# EAGLE board TSC8-75 (EAGLE 6.6.0), part 1 of 2
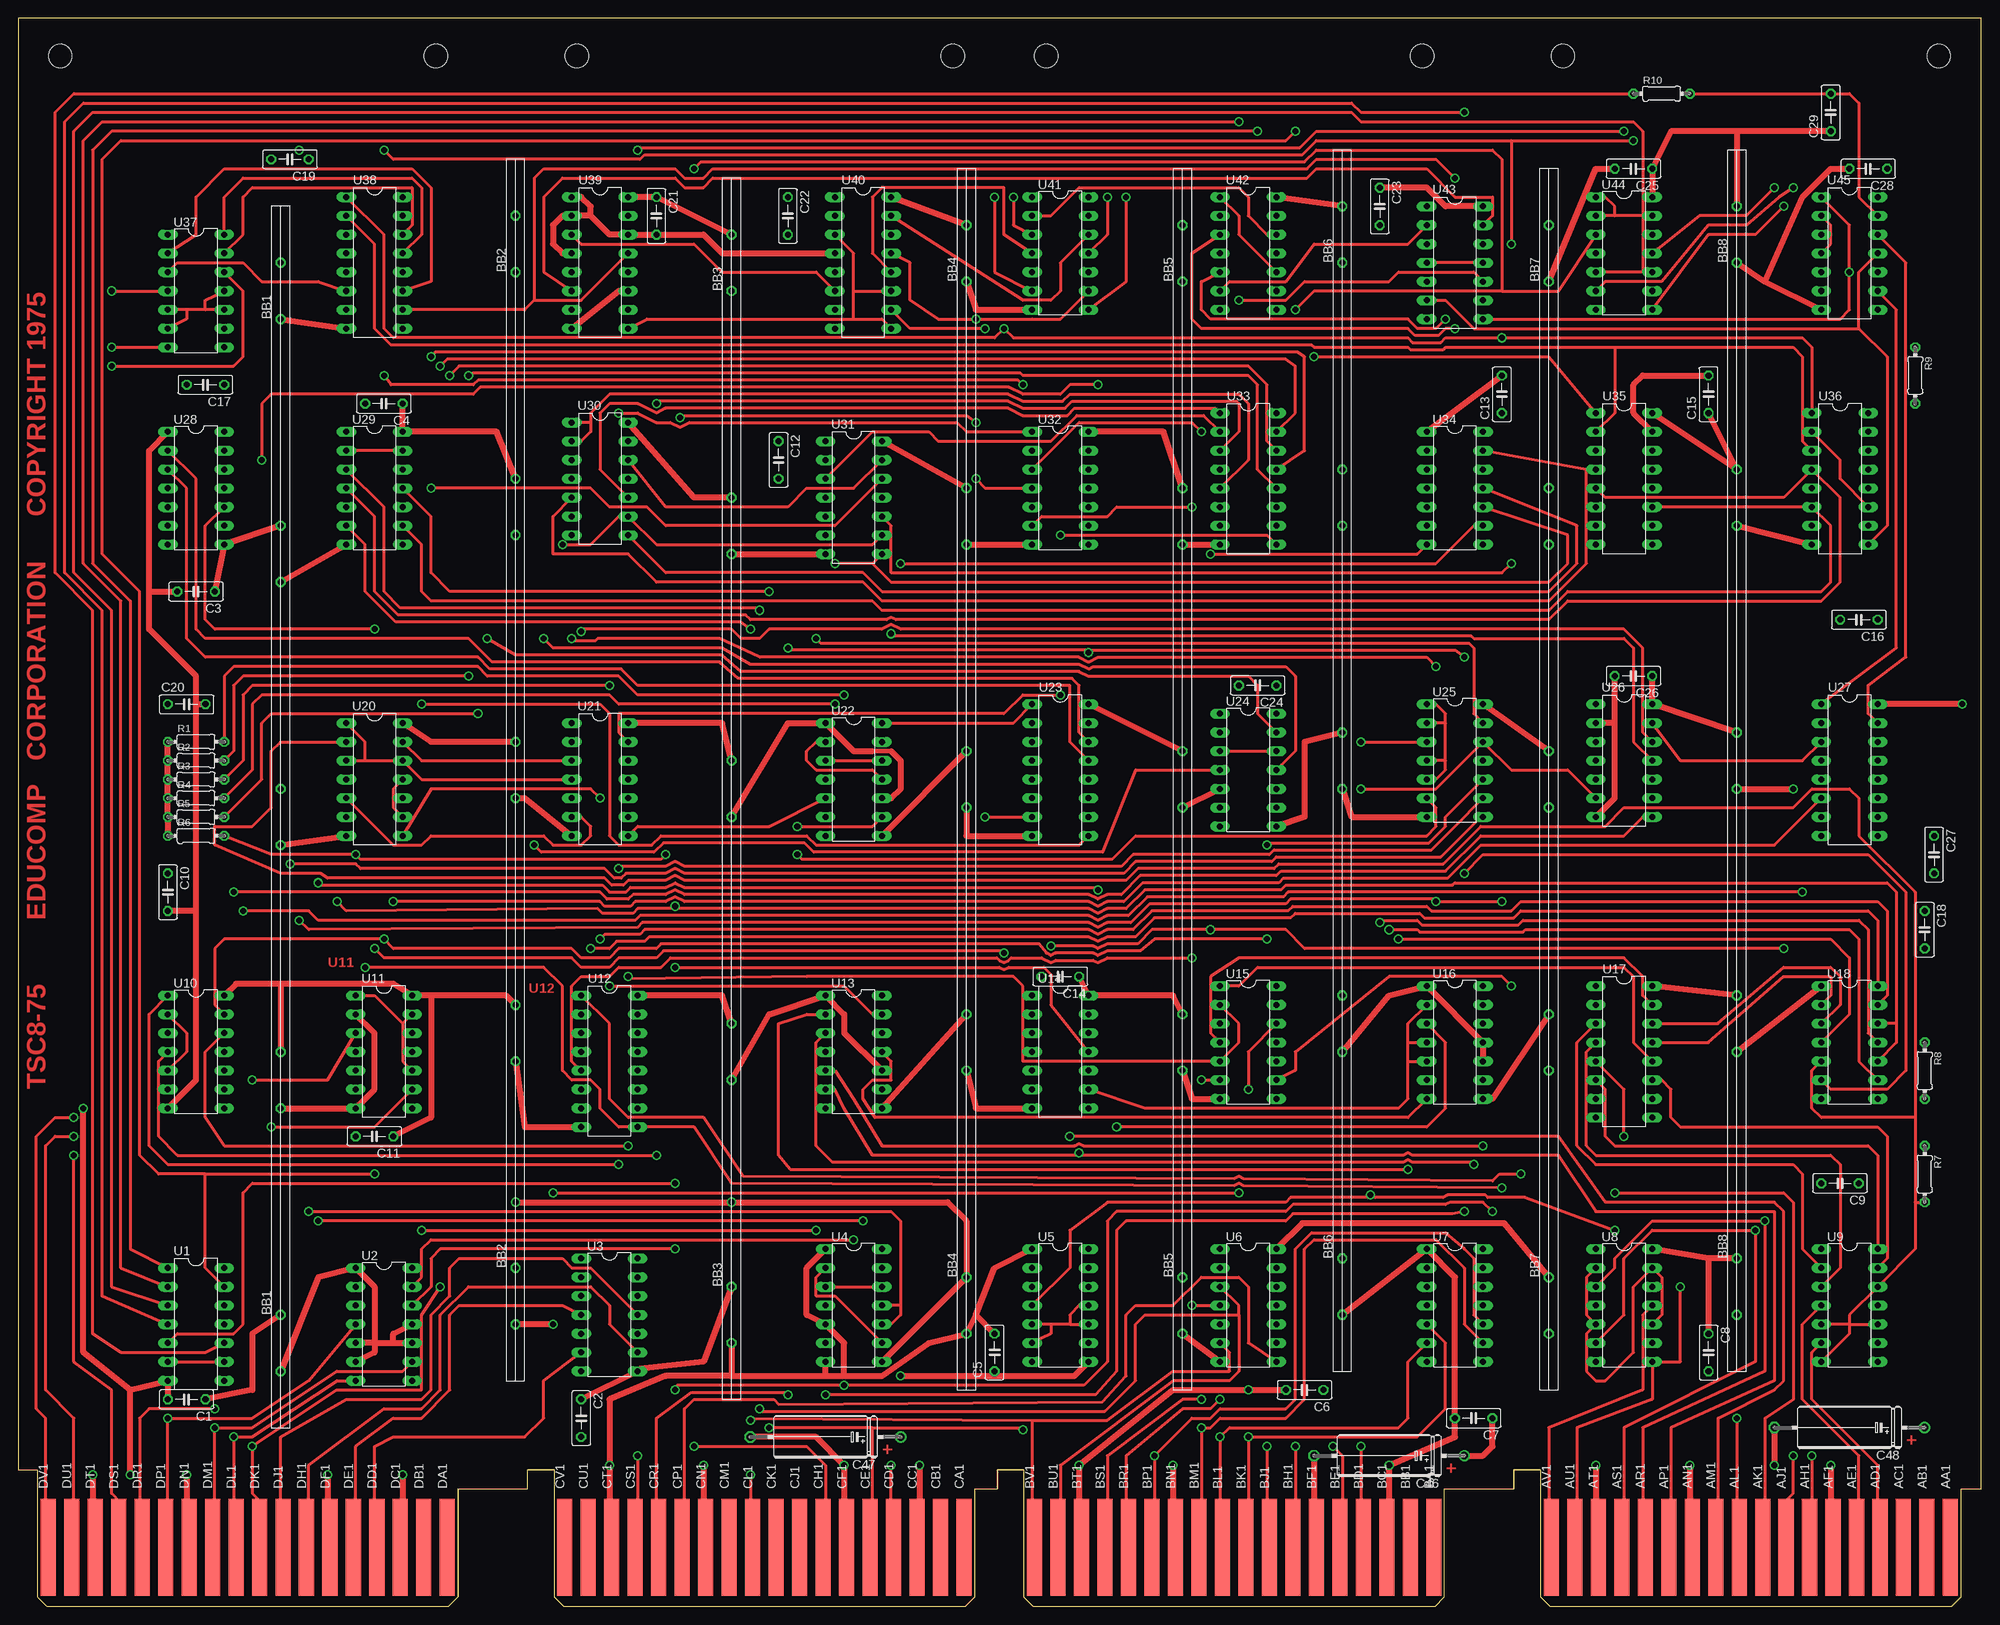
[diagram p4: board, top side]
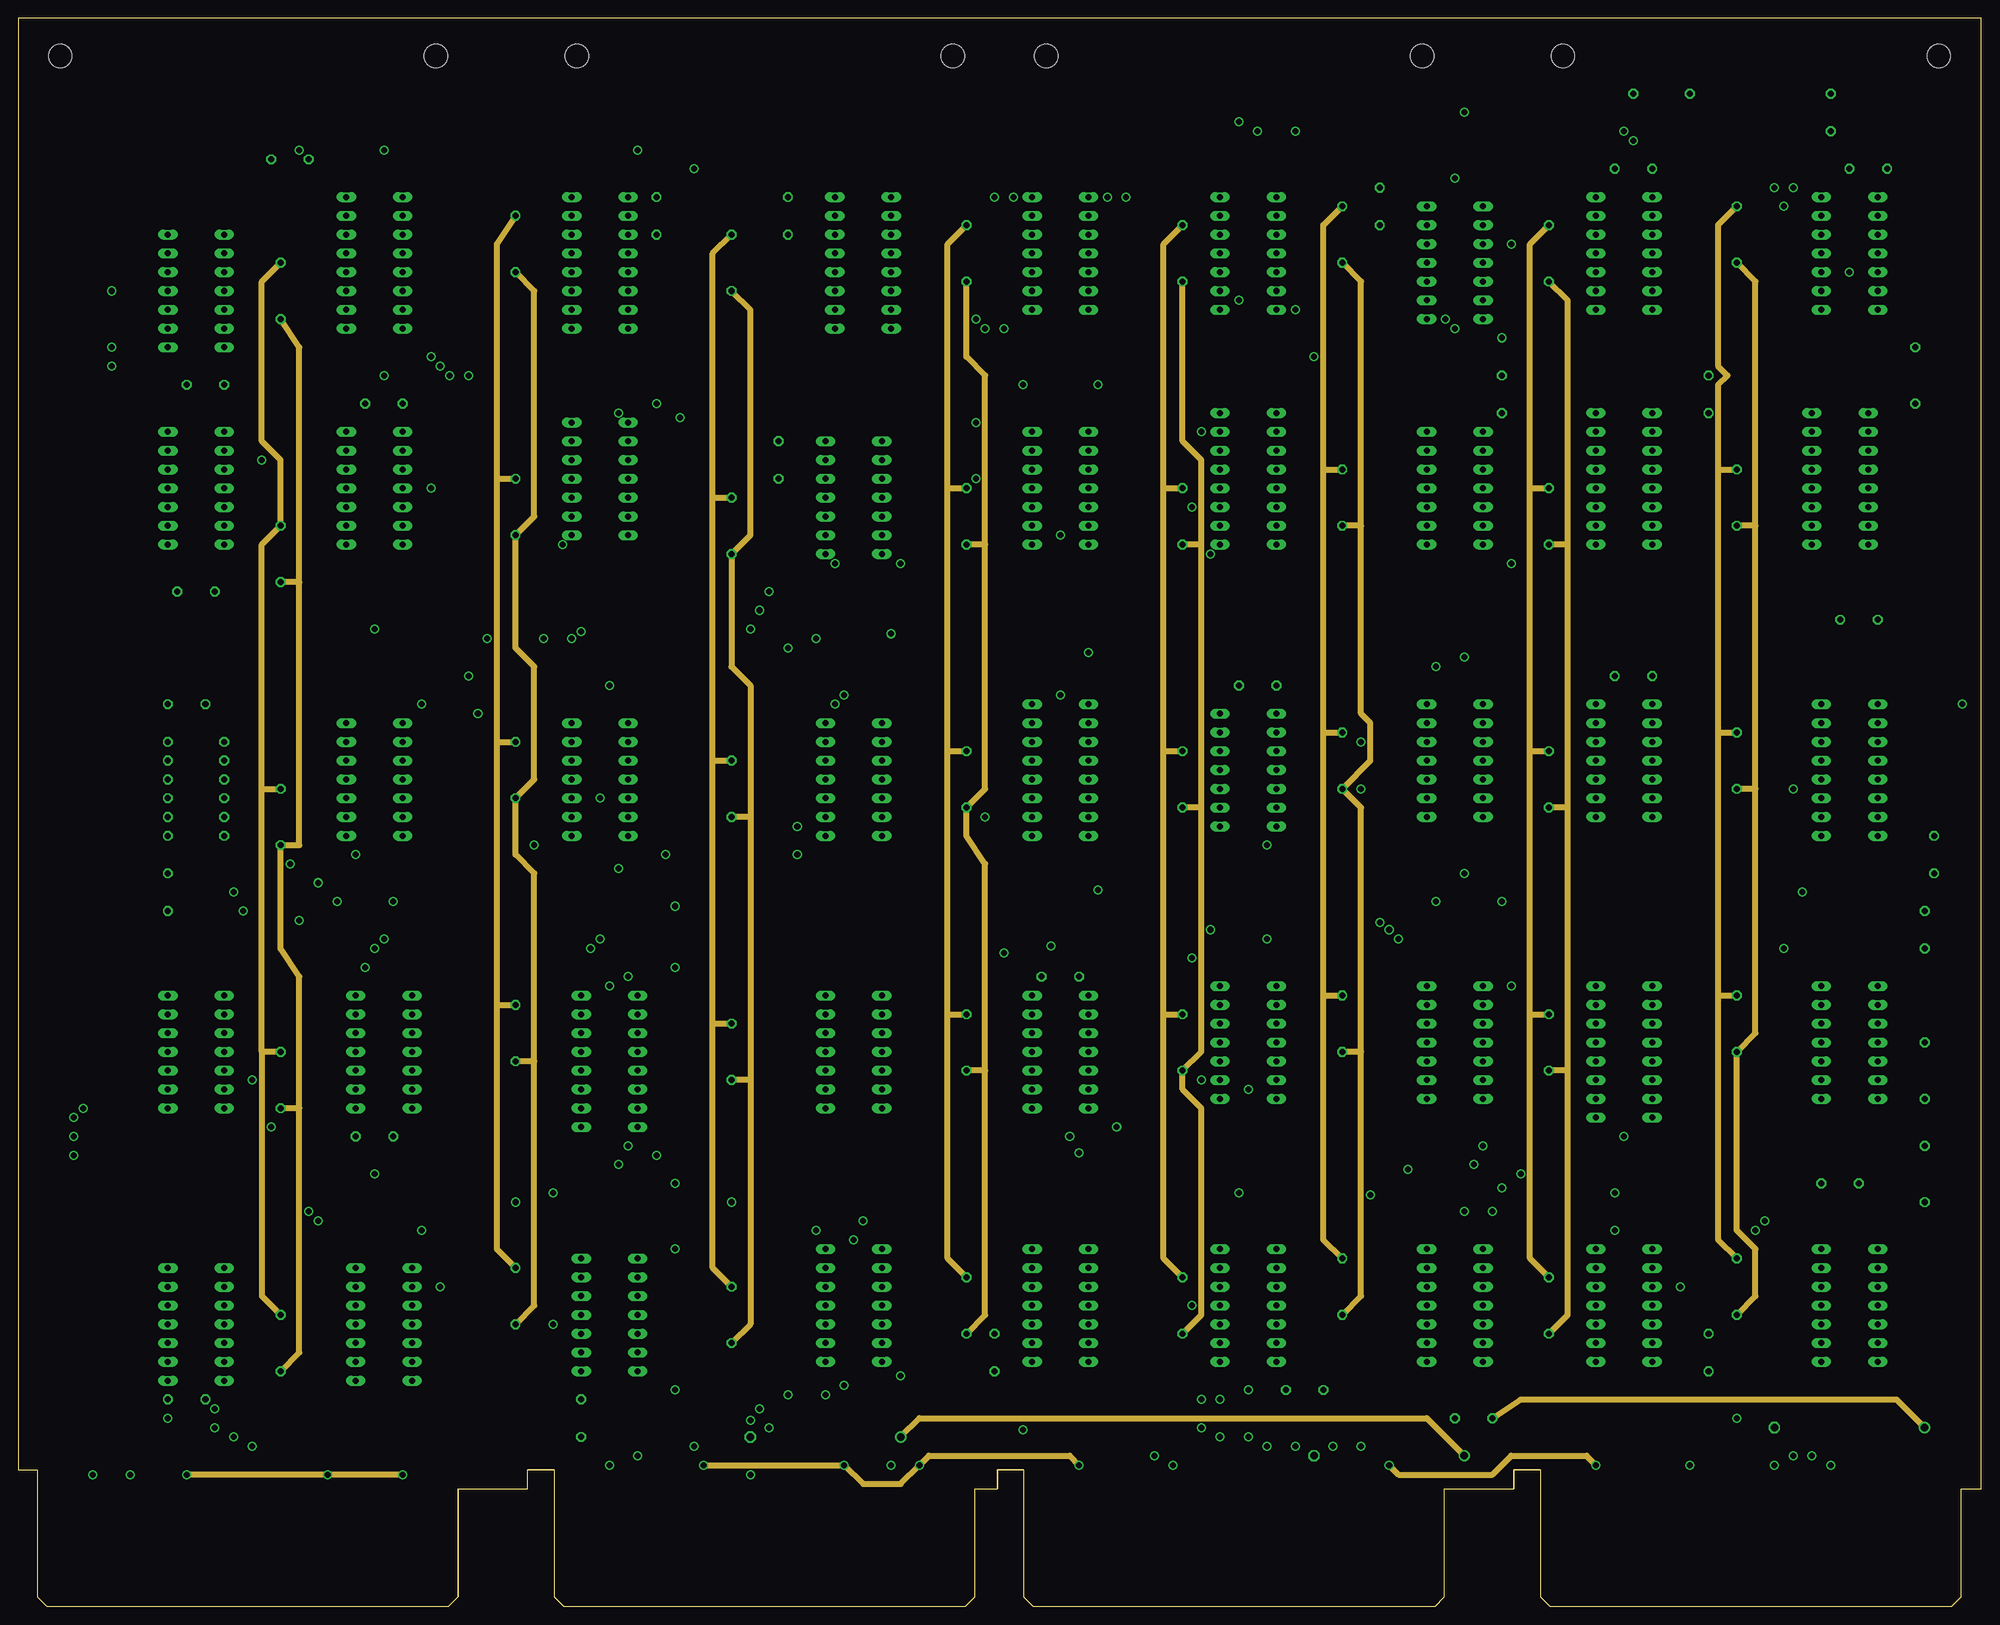
[diagram p5: board, inner layer Busbar]
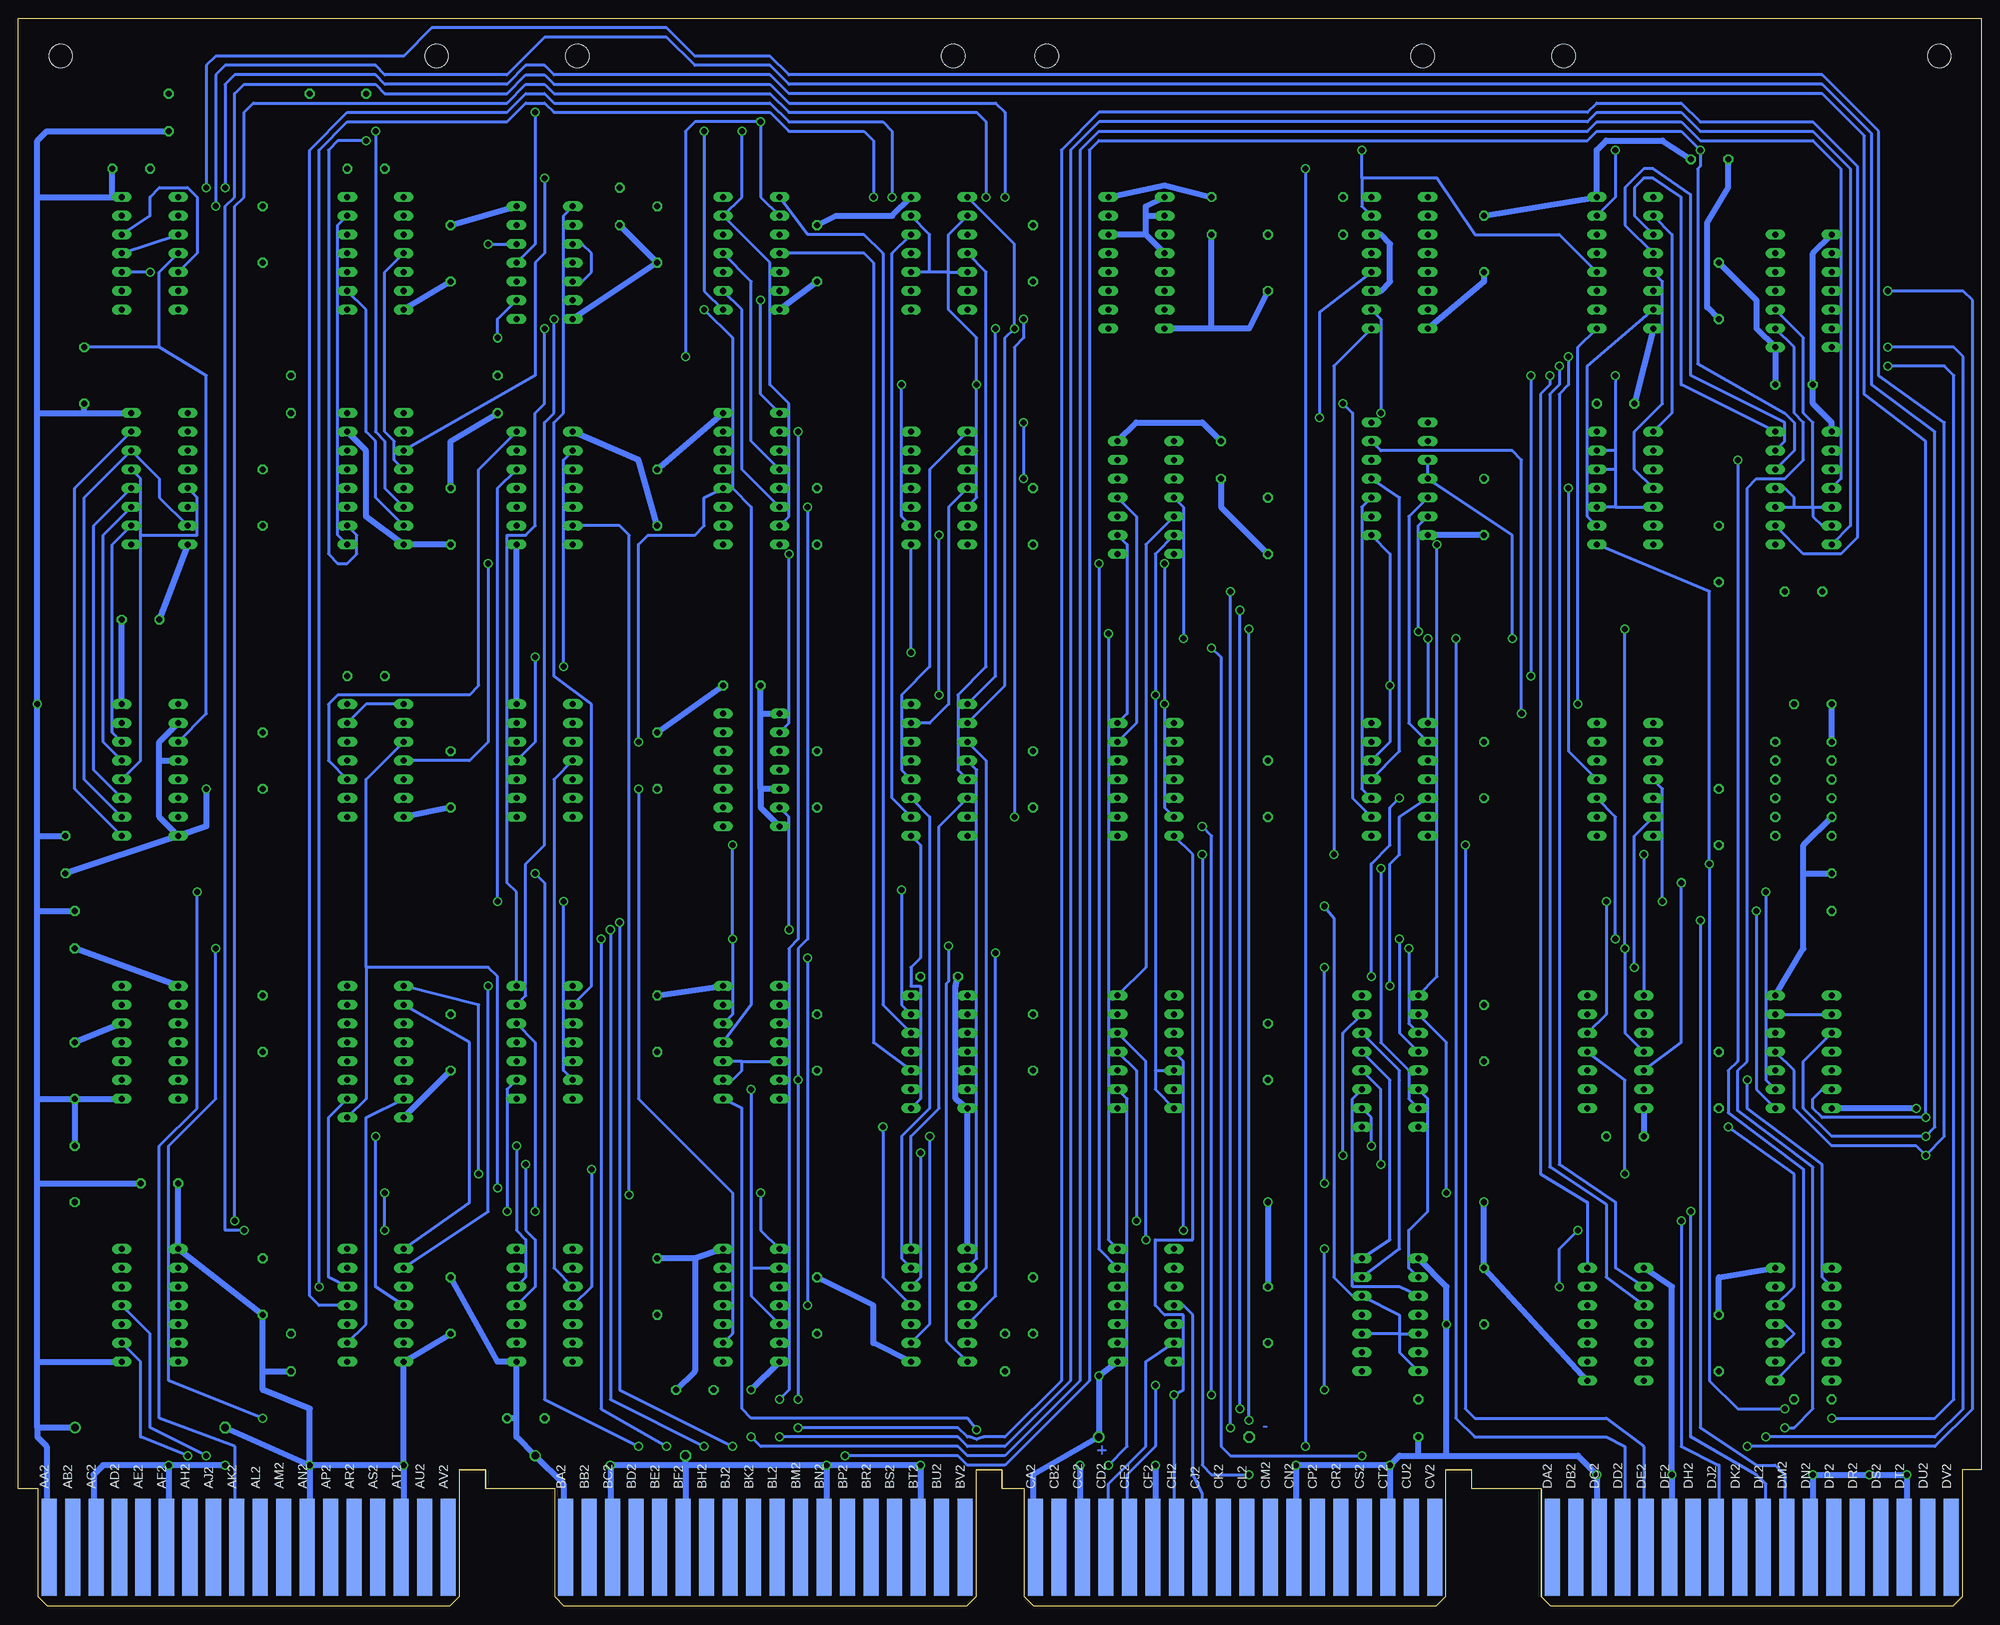
[diagram p6: board, bottom side, seen from below]

Size 265.3 x 214.63 mm. Coordinates in mm from the lower left corner, seen from the top.
Copper layers (1+2+16): Top 0.035mm / dielectric 1.5mm / Busbar 0.035mm / dielectric 0.15mm / Bottom 0.035mm
Design rules "16mils *": minimum track width 16mil, minimum drill 32mil, track to track 15mil, track to pad 10mil, pad to pad 10mil, via to via 10mil, smd to smd 10mil, copper to edge 13mil, drill to drill 10mil, minimum pad ring 10mil, minimum via ring 8mil, stop-mask expansion 0mil, vias tented up to drill 0mil, thermal gap 10mil

## Footprints (pad centres in the part's own frame; a part is rotated, then mirrored left to right if it is on the bottom)
BUSBAR = drill 0.813 octagon: GND1 7.62,1.27; GND2 43.18,1.27; GND3 78.74,1.27; GND4 114.3,1.27; GND5 149.86,1.27; VCC1 15.24,1.27; VCC2 50.8,1.27; VCC3 86.36,1.27; VCC4 121.92,1.27; VCC5 157.48,1.27
C050-025X075 = drill 0.813 octagon: 1 -2.54,0; 2 2.54,0
E12-8 = drill 1.016: + -10.16,0 | drill 1.016 octagon: - 10.16,0
EDGE-CON8 = smd 2.032 x 13.106: AA1 261.303,7.938; AB1 258.127,7.938; AC1 254.952,7.938; AD1 251.778,7.938; AE1 248.602,7.938; AF1 245.428,7.938; AH1 242.252,7.938; AJ1 239.077,7.938; AK1 235.903,7.938; AL1 232.727,7.938; AM1 229.553,7.938; AN1 226.377,7.938; AP1 223.202,7.938; AR1 220.028,7.938; AS1 216.852,7.938; AT1 213.678,7.938; AU1 210.502,7.938; AV1 207.327,7.938; BA1 191.452,7.938; BB1 188.278,7.938; BC1 185.102,7.938; BD1 181.928,7.938; BE1 178.752,7.938; BF1 175.577,7.938; BH1 172.403,7.938; BJ1 169.227,7.938; BK1 166.053,7.938; BL1 162.877,7.938; BM1 159.702,7.938; BN1 156.528,7.938; BP1 153.352,7.938; BR1 150.178,7.938; BS1 147.002,7.938; BT1 143.827,7.938; BU1 140.653,7.938; BV1 137.477,7.938; CA1 127.953,7.938; CB1 124.778,7.938; CC1 121.603,7.938; CD1 118.427,7.938; CE1 115.252,7.938; CF1 112.078,7.938; CH1 108.903,7.938; CJ1 105.728,7.938; CK1 102.552,7.938; CL1 99.377,7.938; CM1 96.203,7.938; CN1 93.028,7.938; CP1 89.853,7.938; CR1 86.677,7.938; CS1 83.502,7.938; CT1 80.328,7.938; CU1 77.153,7.938; CV1 73.978,7.938; DA1 58.102,7.938; DB1 54.928,7.938; DC1 51.752,7.938; DD1 48.578,7.938; DE1 45.403,7.938; DF1 42.227,7.938; DH1 39.053,7.938; DJ1 35.877,7.938; DK1 32.703,7.938; DL1 29.527,7.938; DM1 26.352,7.938; DN1 23.177,7.938; DP1 20.003,7.938; DR1 16.828,7.938; DS1 13.652,7.938; DT1 10.477,7.938; DU1 7.303,7.938; DV1 4.128,7.938 | smd 2.032 x 13.106 bottom: AA2 261.303,7.938; AB2 258.127,7.938; AC2 254.952,7.938; AD2 251.778,7.938; AE2 248.602,7.938; AF2 245.428,7.938; AH2 242.252,7.938; AJ2 239.077,7.938; AK2 235.903,7.938; AL2 232.727,7.938; AM2 229.553,7.938; AN2 226.377,7.938; AP2 223.202,7.938; AR2 220.028,7.938; AS2 216.852,7.938; AT2 213.678,7.938; AU2 210.502,7.938; AV2 207.327,7.938; BA2 191.452,7.938; BB2 188.278,7.938; BC2 185.102,7.938; BD2 181.928,7.938; BE2 178.752,7.938; BF2 175.577,7.938; BH2 172.403,7.938; BJ2 169.227,7.938; BK2 166.053,7.938; BL2 162.877,7.938; BM2 159.702,7.938; BN2 156.528,7.938; BP2 153.352,7.938; BR2 150.178,7.938; BS2 147.002,7.938; BT2 143.827,7.938; BU2 140.653,7.938; BV2 137.477,7.938; CA2 127.953,7.938; CB2 124.778,7.938; CC2 121.603,7.938; CD2 118.427,7.938; CE2 115.252,7.938; CF2 112.078,7.938; CH2 108.903,7.938; CJ2 105.728,7.938; CK2 102.552,7.938; CL2 99.377,7.938; CM2 96.203,7.938; CN2 93.028,7.938; CP2 89.853,7.938; CR2 86.677,7.938; CS2 83.502,7.938; CT2 80.328,7.938; CU2 77.153,7.938; CV2 73.978,7.938; DA2 58.102,7.938; DB2 54.928,7.938; DC2 51.752,7.938; DD2 48.578,7.938; DE2 45.403,7.938; DF2 42.227,7.938; DH2 39.053,7.938; DJ2 35.877,7.938; DK2 32.703,7.938; DL2 29.527,7.938; DM2 26.352,7.938; DN2 23.177,7.938; DP2 20.003,7.938; DR2 16.828,7.938; DS2 13.652,7.938; DT2 10.477,7.938; DU2 7.303,7.938; DV2 4.128,7.938
0204/7 = drill 0.813 octagon: 1 -3.81,0; 2 3.81,0
DIL14 = drill 0.813 long: 1 -7.62,-3.81; 2 -5.08,-3.81; 3 -2.54,-3.81; 4 0,-3.81; 5 2.54,-3.81; 6 5.08,-3.81; 7 7.62,-3.81; 8 7.62,3.81; 9 5.08,3.81; 10 2.54,3.81; 11 0,3.81; 12 -2.54,3.81; 13 -5.08,3.81; 14 -7.62,3.81
DIL16 = drill 0.813 long: 1 -8.89,-3.81; 2 -6.35,-3.81; 3 -3.81,-3.81; 4 -1.27,-3.81; 5 1.27,-3.81; 6 3.81,-3.81; 7 6.35,-3.81; 8 8.89,-3.81; 9 8.89,3.81; 10 6.35,3.81; 11 3.81,3.81; 12 1.27,3.81; 13 -1.27,3.81; 14 -3.81,3.81; 15 -6.35,3.81; 16 -8.89,3.81
OMNIBUS = hole 3.175: 208.915,209.55; 259.715,209.55; 189.865,209.55; 139.065,209.55; 75.616,209.55; 126.416,209.55; 56.566,209.55; 5.766,209.55

## Placement (x,y rotation side)
BB1  BUSBAR  [BUSBAR]  36.7,24.13 90 top
BB2  BUSBAR  [BUSBAR]  68.45,30.48 90 top
BB3  BUSBAR  [BUSBAR]  97.66,27.94 90 top
BB4  BUSBAR  [BUSBAR]  129.41,29.21 90 top
BB5  BUSBAR  [BUSBAR]  158.62,29.21 90 top
BB6  BUSBAR  [BUSBAR]  180.21,31.75 90 top
BB7  BUSBAR  [BUSBAR]  208.15,29.21 90 top
BB8  BUSBAR  [BUSBAR]  233.55,31.75 90 top
C1  .01uF  [C050-025X075]  22.73,27.94 180 top
C2  .01uF  [C050-025X075]  76.07,25.4 270 top
C3  .01uF  [C050-025X075]  24,137.16 180 top
C4  .01uF  [C050-025X075]  49.4,162.56 180 top
C5  .01uF  [C050-025X075]  131.95,34.29 90 top
C6  .01uF  [C050-025X075]  173.86,29.21 180 top
C7  .01uF  [C050-025X075]  196.72,25.4 180 top
C8  .01uF  [C050-025X075]  228.47,34.29 270 top
C9  .01uF  [C050-025X075]  246.25,57.15 180 top
C10  .01uF  [C050-025X075]  20.19,96.52 270 top
C11  .01uF  [C050-025X075]  48.13,63.5 180 top
C12  .01uF  [C050-025X075]  102.74,154.94 270 top
C13  .01uF  [C050-025X075]  200.53,163.83 90 top
C14  .01uF  [C050-025X075]  140.84,85.09 180 top
C15  .01uF  [C050-025X075]  228.47,163.83 90 top
C16  .01uF  [C050-025X075]  248.79,133.35 180 top
C17  .01uF  [C050-025X075]  25.27,165.1 180 top
C18  .01uF  [C050-025X075]  257.68,91.44 270 top
C19  .01uF  [C050-025X075]  36.7,195.58 180 top
C20  .01uF  [C050-025X075]  22.73,121.92 0 top
C21  .01uF  [C050-025X075]  86.23,187.96 270 top
C22  .01uF  [C050-025X075]  104.01,187.96 270 top
C23  .01uF  [C050-025X075]  184.02,189.23 270 top
C24  .01uF  [C050-025X075]  167.51,124.46 180 top
C25  .01uF  [C050-025X075]  218.31,194.31 180 top
C26  .01uF  [C050-025X075]  218.31,125.73 180 top
C27  .01uF  [C050-025X075]  258.95,101.6 270 top
C28  .01uF  [C050-025X075]  250.06,194.31 180 top
C29  100pF  [C050-025X075]  244.98,201.93 90 top
C46  6.8uF  [E12-8]  185.29,20.32 180 top
C47  6.8uF  [E12-8]  109.09,22.86 180 top
C48  6.8uF  [E12-8]  247.52,24.13 180 top
EDGE  edge  [EDGE-CON8]  -0.13,0 0 top
R1  1K  [0204/7]  24,116.84 0 top
R2  1K  [0204/7]  24,114.3 0 top
R3  1K  [0204/7]  24,111.76 0 top
R4  1K  [0204/7]  24,109.22 0 top
R5  1K  [0204/7]  24,106.68 0 top
R6  1K  [0204/7]  24,104.14 0 top
R7  1K  [0204/7]  257.68,58.42 270 top
R8  1K  [0204/7]  257.68,72.39 270 top
R9  1K  [0204/7]  256.41,166.37 270 top
R10  120  [0204/7]  222.12,204.47 0 top
U1  7400N  [DIL14]  24,38.1 270 top
U2  SP380N  [DIL14]  49.4,38.1 270 top
U3  SP380N  [DIL14]  79.88,39.37 270 top
U4  SP380N  [DIL14]  112.9,40.64 270 top
U5  SP380N  [DIL14]  140.84,40.64 270 top
U6  7438N  [DIL14]  166.24,40.64 270 top
U7  SP314N  [DIL14]  194.18,40.64 270 top
U8  7438N  [DIL14]  217.04,40.64 270 top
U9  SP380N  [DIL14]  247.52,40.64 270 top
U10  7438N  [DIL14]  24,74.93 270 top
U11  7474N  [DIL14]  49.4,74.93 270 top
U12  74174N  [DIL16]  79.88,73.66 270 top
U13  SP380N  [DIL14]  112.9,74.93 270 top
U14  7408N  [DIL14]  140.84,74.93 270 top
U15  7438N  [DIL14]  166.24,76.2 270 top
U16  SP380N  [DIL14]  194.18,76.2 270 top
U17  74174N  [DIL16]  217.04,74.93 270 top
U18  SP380N  [DIL14]  247.52,76.2 270 top
U20  7404N  [DIL14]  48.13,111.76 270 top
U21  7400N  [DIL14]  78.61,111.76 270 top
U22  SP380N  [DIL14]  112.9,111.76 270 top
U23  74174N  [DIL16]  140.84,113.03 270 top
U24  SP380N  [DIL14]  166.24,113.03 270 top
U25  7438N  [DIL14]  194.18,114.3 270 top
U26  7474N  [DIL14]  217.04,114.3 270 top
U27  7485N  [DIL16]  247.52,113.03 270 top
U28  SP380N  [DIL14]  24,151.13 270 top
U29  7438N  [DIL14]  48.13,151.13 270 top
U30  7410N  [DIL14]  78.61,152.4 270 top
U31  7404N  [DIL14]  112.9,149.86 270 top
U32  7438N  [DIL14]  140.84,151.13 270 top
U33  7442N  [DIL16]  166.24,152.4 270 top
U34  SP380N  [DIL14]  194.18,151.13 270 top
U35  74157N  [DIL16]  217.04,152.4 270 top
U36  74174N  [DIL16]  246.25,152.4 270 top
U37  SP380N  [DIL14]  24,177.8 270 top
U38  74174N  [DIL16]  48.13,181.61 270 top
U39  7485N  [DIL16]  78.61,181.61 270 top
U40  7485N  [DIL16]  114.17,181.61 270 top
U41  7438N  [DIL14]  140.84,182.88 270 top
U42  7404N  [DIL14]  166.24,182.88 270 top
U43  7408N  [DIL14]  194.18,181.61 270 top
U44  7438N  [DIL14]  217.04,182.88 270 top
U45  7474N  [DIL14]  247.52,182.88 270 top
U$1  OUTLINE-OMNIBUS  [OMNIBUS]  -0.13,0 0 top

## Tracks (layer width: path | path; a pad name or v marks a point on that pad's centre or on a via)
!C0  (via drill 0.81)
  Top 0.406: EDGE.CE1 115.44,8.26 115.44,24.13 | 115.44,24.13 v101.47,24.13 | 115.44,24.13 135.44,24.13 v135.76,23.81 | U29.11 55.75,147.32 55.75,139.7 58.29,137.16 v101.47,137.16
  Bottom 0.406: v101.47,24.13 v101.47,137.16 | v135.76,23.81 137.03,25.4 166.24,25.4 167.51,26.67 167.51,67.31 U15.8
!C1  (via drill 0.81)
  Top 0.406: v91.31,21.59 106.55,21.59 109.09,19.05 109.09,8.26 EDGE.CH1 | v91.31,194.31 92.27,195.26 173.86,195.26 175.45,196.85 199.26,196.85 200.53,195.58 200.53,177.8 | 200.53,177.8 208.15,177.8 U44.3 | v172.59,175.26 175.13,177.8 200.53,177.8
  Bottom 0.406: v91.31,194.31 v91.31,21.59 | U15.11 166.24,81.28 166.24,148.59 168.78,151.13 168.78,171.45 v172.59,175.26
!DATA00  (via drill 0.81)
  Top 0.406: EDGE.AR1 219.58,8.26 219.58,24.13 236.09,31.75 v236.09,52.07 220.85,52.07 215.77,46.99 215.77,45.72 U8.3 | U41.3 134.49,186.69 v134.49,190.5
  Bottom 0.406: v134.49,190.5 134.49,200.66 135.76,201.93 161.16,201.93 163.7,204.47 192.91,204.47 194.18,205.74 196.72,205.74 199.26,203.2 233.55,203.2 234.82,201.93 234.82,190.5 236.09,189.23 v236.09,52.07
!DATA01  (via drill 0.81)
  Top 0.406: EDGE.AS1 217.04,8.26 217.04,24.13 234.82,33.02 v234.82,50.8 220.85,50.8 217.04,46.99 217.04,39.37 U8.6 | U41.6 131.95,180.34 v131.95,190.5
  Bottom 0.406: v234.82,50.8 237.36,50.8 237.36,189.23 236.09,190.5 236.09,204.47 234.82,205.74 217.04,205.74 215.77,204.47 199.26,204.47 196.72,207.01 194.18,207.01 192.91,205.74 163.7,205.74 161.16,203.2 133.22,203.2 131.95,201.93 v131.95,190.5
!DATA02  (via drill 0.81)
  Top 0.406: EDGE.AU1 210.69,8.26 210.69,24.13 220.85,27.94 U8.8 224.66,33.02 v224.66,43.18 | U41.8 149.73,179.07 v149.73,190.5
  Bottom 0.406: v149.73,190.5 149.73,198.12 151,199.39 161.16,199.39 163.7,201.93 192.91,201.93 194.18,203.2 196.72,203.2 199.26,200.66 220.85,200.66 224.66,196.85 v224.66,43.18
!DATA03  (via drill 0.81)
  Top 0.406: EDGE.AV1 206.88,8.26 206.88,24.13 219.58,29.21 219.58,39.37 U8.11 | U41.11 147.19,185.42 v147.19,190.5
  Bottom 0.406: U8.11 224.66,40.64 225.93,41.91 225.93,196.85 220.85,201.93 199.26,201.93 196.72,204.47 194.18,204.47 192.91,203.2 163.7,203.2 161.16,200.66 148.46,200.66 147.19,199.39 v147.19,190.5
!DATA04  (via drill 0.81)
  Top 0.406: EDGE.BR1 149.73,8.26 149.73,20.32 157.35,26.67 161.16,26.67 v162.43,27.94 | v159.89,158.75 158.62,160.02 143.38,160.02 U32.3
  Bottom 0.406: v162.43,27.94 161.16,29.21 161.16,78.74 | 161.16,78.74 161.16,88.9 159.89,90.17 v159.89,158.75 | 161.16,78.74 U15.3
!DATA05  (via drill 0.81)
  Top 0.406: EDGE.BS1 147.19,8.26 147.19,20.32 157.35,27.94 v159.89,27.94 | v159.89,71.12 U15.6 | v158.62,148.59 148.46,148.59 147.19,147.32 138.3,147.32 U32.6
  Bottom 0.406: v159.89,27.94 v159.89,71.12 159.89,88.9 158.62,90.17 v158.62,148.59
!DATA06  (via drill 0.81)
  Top 0.406: EDGE.BU1 140.84,8.26 140.84,19.05 156.08,30.48 163.7,30.48 164.97,31.75 164.97,39.37 | U6.3 164.97,40.64 164.97,39.37 | 164.97,39.37 152.27,39.37 151,38.1 151,30.48 146.88,26.35 100.52,26.35 v100.2,26.67 | v100.2,134.62 99.89,134.94 51.62,134.94 49.4,137.16 49.4,148.59 U29.3
  Bottom 0.406: v100.2,26.67 v100.2,134.62
!DATA07  (via drill 0.81)
  Top 0.406: EDGE.BV1 137.03,8.26 137.03,25.08 | 137.03,25.08 147.19,25.08 156.08,31.75 163.7,31.75 163.7,34.29 U6.6 | v98.93,25.08 99.25,25.4 137.03,25.08 | v98.93,132.08 97.66,133.03 50.99,133.03 46.86,137.16 46.86,143.51 U29.6
  Bottom 0.406: v98.93,132.08 98.93,25.4 v98.93,25.08
!DATA08  (via drill 0.81)
  Top 0.406: EDGE.DR1 16.38,8.26 16.38,25.4 17.65,26.67 v26.54,26.67 | v36.7,100.33 45.59,100.33 46.23,99.69 79.25,99.69 80.52,98.42 81.47,98.42 82.11,99.06 87.5,99.06 88.77,99.69 90.04,99.06 149.41,99.06 151,100.65 169.42,100.65 170.05,101.28 192.28,101.28 197.68,106.68 U25.8
  Bottom 0.406: v26.54,26.67 32.89,26.67 36.7,30.48 v36.7,100.33 36.7,137.16 U29.8
!DATA09  (via drill 0.81)
  Top 0.406: EDGE.DS1 13.84,8.26 13.84,13.97 12.57,15.24 12.57,29.21 7.49,33.02 v7.49,60.96 | v239.9,191.77 238,190.5 233.55,186.69 228.47,186.69 222.12,179.07 214.5,179.07 U44.6
  Bottom 0.406: v239.9,191.77 239.9,208.28 238.63,209.55 213.23,209.55 209.42,213.36 177.67,213.36 173.86,209.55 163.7,209.55 161.16,207.01 21.46,207.01 13.84,199.39 13.84,166.37 4.95,160.02 4.95,63.5 v7.49,60.96 8.76,62.23 20.19,62.23 25.27,67.31 25.27,72.39 U10.11
!DATA10  (via drill 0.81)
  Top 0.406: EDGE.DU1 7.49,8.26 7.49,25.4 3.68,29.21 3.68,62.23 4.95,63.5 v7.49,63.5 | v238.63,189.23 234.82,185.42 228.47,185.42 U44.8
  Bottom 0.406: v238.63,189.23 238.63,207.01 237.36,208.28 217.04,208.28 215.77,207.01 199.26,207.01 194.18,212.09 177.67,212.09 173.86,208.28 163.7,208.28 161.16,205.74 21.46,205.74 14.79,199.07 14.79,165.1 6.22,158.75 6.22,64.77 v7.49,63.5 20.19,63.5 24,67.31 24,73.66 U10.3
!DATA11  (via drill 0.81)
  Top 0.406: EDGE.DV1 3.68,8.26 3.68,25.4 2.41,26.67 2.41,63.5 4.95,66.04 v7.49,66.04 | v237.36,191.77 233.55,187.96 227.2,187.96 U44.11
  Bottom 0.406: v237.36,191.77 237.36,205.74 236.09,207.01 217.04,207.01 215.77,205.74 199.26,205.74 196.72,208.28 194.18,208.28 192.91,207.01 163.7,207.01 161.16,204.47 21.46,204.47 15.75,198.75 15.75,163.83 7.49,157.48 v7.49,66.04 21.46,66.04 22.73,67.31 22.73,68.58 21.46,69.85 U10.6
!E  (via drill 0.81)
  Top 0.406: 119.25,40.64 U4.11 | v39.24,53.34 117.98,53.34 119.25,52.07 119.25,40.64 | U4.10 117.98,38.1 119.25,39.37 119.25,40.64
  Bottom 0.406: EDGE.DL2 29.08,8.89 29.08,16.51 30.35,17.78 39.24,22.86 v39.24,53.34
!ECDF
  Bottom 0.406: U33.4 166.24,157.48 166.24,179.07 U42.11
!ECTF  (via drill 0.81)
  Top 0.406: U33.3 164.97,158.75 164.97,162.56 164.66,162.88 142.43,162.88 141.48,161.93 135.76,161.93 133.86,162.88 86.55,162.88 v86.23,162.56
  Bottom 0.406: U21.9 84.96,109.22 84.96,161.29 v86.23,162.56
!ERIOT  (via drill 0.81)
  Top 0.406: U1.1 15.11,48.26 15.11,135.89 10.03,140.97 10.03,196.85 12.57,199.39 v167.51,199.39
  Bottom 0.406: U33.7 161.16,147.32 161.16,162.56 163.7,165.1 163.7,181.61 U42.13 167.51,190.5 v167.51,199.39
!ERTB
  Top 0.406: U33.5 166.24,154.94 166.24,162.56 164.97,163.83 142.11,163.83 141.16,162.88 135.76,162.88 133.86,163.83 79.88,163.83 77.34,161.29 77.34,160.02 | U30.2 76.07,157.48 77.34,158.75 77.34,160.02 | 77.34,160.02 U30.1
!ESKP
  Top 0.406: U33.2 160.21,160.97 143.06,160.97 139.57,157.48 124.33,157.48 123.06,158.75 115.44,158.75 U31.3
!ESME
  Bottom 0.406: U33.6 167.51,153.67 167.51,175.26 U42.9
!ETDS  (via drill 0.81)
  Top 0.406: U33.1 161.8,161.93 142.75,161.93 141.8,160.97 135.76,160.97 133.86,161.93 87.5,161.93 86.23,161.29 83.69,162.56 79.88,162.56 78.61,161.29 78.61,153.67 U30.10 | v164.97,176.53 171.32,176.53 173.86,179.07 185.29,179.07 186.56,180.34 196.72,180.34 U43.10
  Bottom 0.406: U33.1 164.97,163.83 v164.97,176.53 | U21.10 83.69,110.49 83.69,148.59 U30.10
!ETEN  (via drill 0.81)
  Top 0.406: U33.9 168.78,144.78 v140.84,144.78 | v140.84,123.19 135.76,123.19 133.22,120.65 81.15,120.65 81.15,118.11 U21.13
  Bottom 0.406: v140.84,123.19 v140.84,144.78
!F  (via drill 0.81)
  Top 0.406: v114.17,52.07 v40.51,52.07 | U13.11 117.98,73.66 117.98,71.12 115.44,71.12 114.17,69.85 114.17,68.58 115.76,66.04 187.83,66.04 U16.7
  Bottom 0.406: EDGE.DJ2 35.43,8.89 35.43,19.05 40.51,21.59 v40.51,52.07 | v114.17,52.07 114.17,72.39 U13.11
!INITIALIZE  (via drill 0.81)
  Top 0.406: U36.1 242.44,170.18 241.17,171.45 v200.53,171.45 192.91,171.45 192.28,170.81 188.47,170.81 187.83,171.45 134.49,171.45 v133.22,172.72 131.95,171.45 50.67,171.45 49.4,172.72 49.4,185.42 U38.1 | U22.14 134.49,119.38 U23.1 | v203.07,58.42 200.22,58.42 199.26,57.47 165.61,57.78 164.97,58.1 164.34,57.78 97.98,58.1 92.58,66.04 82.42,66.04 79.88,68.58 79.88,78.74 U12.1 | v73.53,143.51 77.34,143.51 81.15,147.32 U30.9 86.23,143.51 115.44,143.51 U31.9
  Bottom 0.406: U22.14 115.44,120.65 115.44,143.51 U31.9 | U23.1 133.22,125.73 v133.22,172.72 | U43.9 200.53,173.99 v200.53,171.45 | U17.1 203.07,81.28 v203.07,58.42 | U12.1 73.53,85.09 v73.53,143.51
!INT_RQST
  Top 0.406: EDGE.CP1 90.04,8.26 90.04,26.67 91.31,27.94 102.11,27.94 102.74,27.3 146.56,27.62 149.73,31.11 149.73,39.37 151,40.64 156.08,40.64 159.89,44.45 164.97,44.45 166.24,43.18 166.24,35.56 U6.8
!INTERNAL_IO  (via drill 0.81)
  Top 0.406: EDGE.CL1 98.93,8.26 v98.93,17.78 | v105.28,101.6 105.92,100.97 147.83,100.97 151,104.14 190.37,104.14 191.64,105.41 191.64,107.95 U25.6
  Bottom 0.406: v98.93,17.78 104.01,17.78 105.28,19.05 v105.28,101.6
!IO_PAUSE  (via drill 0.81)
  Top 0.406: EDGE.CD1 117.98,8.26 v117.98,19.05
  Bottom 0.406: v117.98,19.05 115.44,21.59 115.44,68.58 U13.9
!IR0  (via drill 0.81)
  Top 0.406: v70.99,130.81 72.26,129.54 95.12,129.54 98.93,127.32 143.38,127.32 144.65,126.68 145.29,127 171.32,127 172.59,125.73 172.59,115.57 U24.11
  Bottom 0.406: EDGE.DD2 48.13,8.89 48.13,21.59 50.67,22.86 68.45,22.86 70.99,25.4 v70.99,130.81
!IR1  (via drill 0.81)
  Top 0.406: v69.72,102.87 70.68,101.92 85.92,101.92 87.19,103.19 106.23,103.19 107.51,101.92 146.56,101.92 151,113.03 U24.4
  Bottom 0.406: EDGE.DE2 45.59,8.89 45.59,21.59 50.67,25.4 68.45,25.4 69.72,26.67 v69.72,102.87
!MA00
  Top 0.406: U9.6 242.44,34.29 242.44,27.94 251.33,19.05 251.33,7.94 EDGE.AD1
!MA01
  Top 0.406: U9.4 241.17,38.1 241.17,27.94 248.79,20.32 248.79,8.89 EDGE.AE1
!MA02  (via drill 0.81)
  Top 0.406: EDGE.AH1 242.44,7.94 v242.44,20.32
  Bottom 0.406: v242.44,20.32 248.79,22.86 248.79,33.02 U9.9
!MA03  (via drill 0.81)
  Top 0.406: EDGE.AJ1 238.63,7.94 238.63,13.97 239.9,15.24 v239.9,20.32
  Bottom 0.406: v239.9,20.32 247.52,24.13 247.52,36.83 U9.11
!MA04  (via drill 0.81)
  Top 0.406: EDGE.BD1 181.48,8.26 v181.48,21.59 | v195.45,99.06 197.99,101.6 250.06,101.6 255.14,96.52 255.14,72.39 252.6,69.85 244.98,69.85 U18.6
  Bottom 0.406: v195.45,99.06 194.18,97.79 194.18,27.94 v181.48,21.59
!MA05  (via drill 0.81)
  Top 0.406: EDGE.BE1 178.94,8.26 178.94,20.32 v177.67,21.59 | v186.56,90.17 244.98,90.17 247.52,87.63 247.52,80.01 U18.4
  Bottom 0.406: v177.67,21.59 186.56,26.67 v186.56,90.17
!MA06  (via drill 0.81)
  Top 0.406: EDGE.BH1 172.59,8.26 v172.59,21.59 | v185.29,91.44 189.1,91.44 189.42,91.12 203.39,91.12 203.71,91.44 247.52,91.44 248.79,90.17 248.79,73.66 U18.9
  Bottom 0.406: v172.59,21.59 185.29,27.94 v185.29,91.44
!MA07  (via drill 0.81)
  Top 0.406: EDGE.BJ1 168.78,8.26 v168.78,21.59 | v184.02,92.39 184.34,92.71 189.1,92.71 189.74,92.08 202.75,92.08 203.39,92.71 248.79,92.71 250.06,91.44 250.06,77.47 U18.11
  Bottom 0.406: v168.78,21.59 184.02,29.21 v184.02,92.39
!MA08
  Top 0.406: EDGE.DD1 48.13,8.26 48.13,21.59 50.67,22.86 68.45,22.86 70.99,25.4 70.99,30.48 U3.6
!MA09
  Top 0.406: EDGE.DE1 45.59,8.26 45.59,21.59 50.67,25.4 54.48,25.4 58.29,29.21 58.29,39.37 59.56,40.64 73.53,40.64 U3.4
!MA10
  Top 0.406: EDGE.DH1 39.24,8.26 39.24,19.05 49.4,26.67 54.48,26.67 57.02,29.21 57.02,39.37 60.83,43.18 77.34,43.18 79.88,40.64 79.88,38.1 U3.9
!MA11
  Top 0.406: EDGE.DJ1 35.43,8.26 35.43,22.86 44.32,27.94 54.48,27.94 55.75,29.21 55.75,39.37 58.29,41.91 58.29,45.72 59.56,46.99 73.53,46.99 74.8,45.72 77.34,45.72 U3.11
!MD00  (via drill 0.81)
  Top 0.406: EDGE.AK1 236.09,8.26 236.09,25.4 239.9,27.94 239.9,54.61 238.63,55.88 v215.77,55.88 | v215.77,50.8 203.71,55.24 198.63,55.24 198.31,55.56 193.23,55.56 192.59,55.24 183.39,55.24 v182.75,55.56 182.44,55.24 171.96,55.24 171.32,54.61 147.19,54.61 142.11,50.8 142.11,45.72 U5.4
  Bottom 0.406: U34.6 184.02,146.05 182.75,144.78 v182.75,55.56 | v215.77,50.8 v215.77,55.88
!MD01  (via drill 0.81)
  Top 0.406: EDGE.AL1 232.28,8.26 v232.28,25.4 | v238.63,88.9 173.86,88.9 171.32,91.44 v161.16,91.44 153.22,91.44 151.32,89.53 147.19,89.53 145.92,88.9 145.29,89.22 v139.57,89.22
  Bottom 0.406: v232.28,25.4 244.98,30.48 244.98,62.23 238.63,68.58 v238.63,88.9 | U5.7 139.89,35.88 139.89,84.14 139.57,84.45 v139.57,89.22 | v161.16,91.44 161.16,106.68 U24.6
!MD02  (via drill 0.81)
  Top 0.406: EDGE.AM1 229.74,8.26 229.74,25.4 237.36,29.21 238.63,30.48 238.63,53.34 237.36,54.61 214.5,54.61 208.15,63.5 v142.11,63.5
  Bottom 0.406: U5.9 142.11,38.1 v142.11,63.5
!MD03  (via drill 0.81)
  Top 0.406: EDGE.AP1 223.39,8.26 223.39,24.13 237.36,30.48 237.36,53.34 213.23,53.34 208.15,60.96 188.47,60.96 187.83,61.28 187.2,60.96 143.7,60.96 v143.38,61.28 143.06,60.96 115.44,60.96 111.63,67.31 110.36,69.85 U13.6
  Bottom 0.406: U5.12 143.38,44.45 v143.38,61.28
!MD04  (via drill 0.81)
  Top 0.406: EDGE.BK1 166.24,8.26 v166.24,22.86 189.1,22.86 192.91,26.67 192.91,35.56 U7.5
  Bottom 0.406: U28.4 18.92,152.4 18.92,194.31 22.73,198.12 37.97,198.12 40.51,200.66 51.94,200.66 53.21,199.39 119.25,199.39 121.79,196.85 121.79,30.48 131.95,20.32 137.03,20.32 138.3,21.59 164.97,21.59 v166.24,22.86
!MD05  (via drill 0.81)
  Top 0.406: EDGE.BL1 162.43,8.26 v162.43,22.86 163.7,24.13 186.56,24.13 187.83,25.4 187.83,33.02 U7.6
  Bottom 0.406: U28.7 17.65,146.05 17.65,194.31 22.73,199.39 37.97,199.39 40.51,201.93 51.94,201.93 53.21,200.66 119.25,200.66 123.06,196.85 123.06,30.48 131.95,21.59 137.03,21.59 138.3,22.86 v162.43,22.86
!MD06  (via drill 0.81)
  Top 0.406: EDGE.BM1 159.89,8.26 v159.89,24.13 161.16,24.13 162.43,25.4 171.32,25.4 173.86,27.94 173.86,48.26 175.13,49.53 191.64,49.53 195.45,45.72 195.45,38.1 U7.9
  Bottom 0.406: U28.9 24,142.24 18.92,142.24 16.7,144.46 16.7,185.74 16.7,194.63 22.73,200.66 37.97,200.66 40.51,203.2 51.94,203.2 53.21,201.93 119.25,201.93 124.33,196.85 124.33,30.48 131.95,22.86 134.81,22.86 135.76,22.54 136.72,22.86 137.03,22.86 138.3,24.13 v159.89,24.13
!MD07  (via drill 0.81)
  Top 0.406: EDGE.BP1 153.54,8.26 v153.54,20.32 158.62,25.4 161.16,25.4 162.43,26.67 171.32,26.67 172.59,27.94 172.59,48.26 174.81,50.48 192.91,50.48 195.45,48.26 196.72,46.99 196.72,39.37 U7.10
  Bottom 0.406: U28.12 25.27,156.21 25.27,160.02 26.54,161.29 38.29,167.96 38.29,194.31 37.97,194.63 v37.97,196.85 40.51,199.39 51.94,199.39 53.21,198.12 119.25,198.12 120.52,196.85 120.52,30.48 131.95,19.05 137.03,19.05 138.3,20.32 v153.54,20.32
!MD08  (via drill 0.81)
  Top 0.406: EDGE.DK1 32.89,8.26 32.89,13.97 31.62,15.24 v31.62,21.59 43.05,29.21 54.48,29.21 54.48,39.37 v57.02,43.18 | v12.57,177.8 U37.4 | v54.48,50.8 v107.82,50.8
  Bottom 0.406: v31.62,21.59 6.22,21.59 1.14,26.67 1.14,176.53 2.41,177.8 v12.57,177.8 | v54.48,50.8 57.02,48.26 v57.02,43.18 | v107.82,50.8 107.82,73.66 U13.4
!MD09  (via drill 0.81)
  Top 0.406: EDGE.DL1 29.08,8.26 v29.08,22.86 31.62,22.86 43.05,30.48 U2.7 | v12.57,170.18 U37.7
  Bottom 0.406: v29.08,22.86 6.22,22.86 2.41,26.67 2.41,168.91 3.68,170.18 v12.57,170.18
!MD10  (via drill 0.81)
  Top 0.406: EDGE.DM1 26.54,8.26 v26.54,24.13 31.62,24.13 43.05,31.75 51.94,31.75 U2.9
  Bottom 0.406: v26.54,24.13 25.27,24.13 22.73,26.67 22.73,59.37 32.89,66.99 32.89,72.39 31.62,73.66 31.62,151.13 30.35,152.4 26.54,152.4 24,154.94 24,160.02 25.27,161.29 25.27,170.18 U37.9
!MD11  (via drill 0.81)
  Top 0.406: EDGE.DP1 20.19,8.26 v20.19,25.4 31.62,25.4 39.24,30.48 U2.4 | U37.12 30.35,177.8 30.35,168.91 29.08,167.64 v12.57,167.64
  Bottom 0.406: v20.19,25.4 6.22,25.4 3.68,27.94 3.68,166.37 4.95,167.64 v12.57,167.64
!MD_DIR  (via drill 0.81)
  Top 0.406: v30.35,93.98 39.24,93.98 40.51,92.71 83.38,92.71 84.01,93.34 144.65,93.34 145.92,92.71 147.19,93.34 150.05,93.34 152.59,95.89 171,95.89 171.64,96.52 v241.17,96.52
  Bottom 0.406: EDGE.AK2 236.09,8.89 236.09,21.59 246.25,25.4 246.25,62.23 241.17,67.31 v241.17,96.52 | U10.8 30.35,69.85 v30.35,93.98
!SKIP  (via drill 0.81)
  Top 0.406: EDGE.CS1 83.69,8.89 v83.69,20.32 | v104.01,129.54 104.33,129.22 144.34,129.22 v144.65,128.91 144.97,129.22 194.18,129.22 v195.45,128.27
  Bottom 0.406: v83.69,20.32 101.47,20.32 102.74,21.59 102.74,128.27 v104.01,129.54 | v144.65,128.91 U32.8 | U25.11 195.45,116.84 v195.45,128.27
!TP1
  Top 0.406: U4.2 107.82,44.45 107.82,41.91 110.36,41.91 U4.9
!TP2  (via drill 0.81)
  Top 0.406: U2.13 54.48,44.45 54.48,48.26 55.75,49.53 v112.9,49.53
  Bottom 0.406: U13.12 112.9,73.66 v112.9,49.53
!TP3  (via drill 0.81)
  Top 0.406: U42.5 159.89,179.07 159.89,175.26 161.16,173.99 187.83,173.99 189.1,172.72 191.64,172.72 v192.91,173.99
  Bottom 0.406: U16.13 196.72,82.55 196.72,100.33 194.18,102.87 194.18,160.02 192.91,161.29 v192.91,173.99
!TP4
  Top 0.406: U4.3 U4.12
+3VA  (via drill 0.81)
  Top 0.406: v87.5,101.6 86.87,100.97 46.23,100.97 v45.59,101.6 34.16,101.6 R6.2 | U39.9 84.96,173.99 112.9,173.99 | U40.9 116.71,173.99 112.9,173.99 | U40.3 112.9,182.88 112.9,177.8 | 112.9,173.99 112.9,177.8 | 112.9,177.8 U40.11 | U11.1 48.13,82.55 51.94,78.74 | U11.10 51.94,73.66 51.94,78.74 | 51.94,78.74 U11.13
  Bottom 0.406: v45.59,101.6 U11.1 | v87.5,101.6 87.5,167.64 U39.9
+3VB
  Top 0.406: U27.3 241.17,114.3 224.66,114.3 U26.13 | U45.2 244.98,186.69 244.98,184.15 U45.4
  Bottom 0.406: U26.1 218.31,121.92 U26.13 | 246.25,170.18 R9.1 | 246.25,170.18 246.25,180.34 U45.4 | 246.25,170.18 239.9,166.37 239.9,120.65 U27.3
BECDF  (via drill 0.81)
  Top 0.406: U35.1 206.88,168.91 v175.13,168.91 | U1.2 13.84,45.72 13.84,135.89 8.76,140.97 8.76,198.12 11.3,200.66 v164.97,200.66 | v31.62,71.12 41.78,71.12 U11.3
  Bottom 0.406: v175.13,168.91 175.13,199.39 173.86,200.66 v164.97,200.66 164.97,190.5 U42.2 | U1.2 21.46,44.45 21.46,59.69 31.62,67.31 v31.62,71.12
BTP2
  Bottom 0.406: U14.10 149.73,76.2 149.73,181.61 151,182.88 U42.4
BTP3
  Top 0.406: U42.6 163.7,179.07 171.32,179.07 175.13,184.15 187.83,184.15 U43.2
ECDF
  Top 0.406: U42.10 164.97,185.42 164.97,187.96 U42.1
  Bottom 0.406: U14.12 148.46,81.28 148.46,182.88 151,185.42 158.62,185.42 U42.1
ECDF_F  (via drill 0.81)
  Top 0.406: v40.51,97.79 40.83,97.47 78.93,97.47 79.88,96.52 82.11,96.52 82.74,97.16 87.5,97.16 88.77,97.79 90.04,97.16 145.6,97.16 v145.92,96.84
  Bottom 0.406: U14.13 145.92,81.28 v145.92,96.84 | U11.5 40.51,76.2 v40.51,97.79
ENABLED
  Top 0.406: U34.13 211.96,153.67 211.96,140.97 206.88,135.89 116.71,135.89 114.17,138.43 86.23,138.43 82.42,142.24 72.26,142.24 72.26,147.32 U30.5
  Bottom 0.406: U30.5 77.34,147.32 77.34,119.38 U21.2
ERIOT  (via drill 0.81)
  Top 0.406: U42.12 168.78,185.42 166.24,187.96 166.24,190.5 164.97,191.77 143.38,191.77 139.57,187.96 U41.2 | v49.4,166.37 50.36,165.1 61.47,165.1 62.1,165.74 135.13,165.74 v135.76,165.1 | U29.13 U29.2
  Bottom 0.406: U32.5 135.76,149.86 135.76,156.21 | 135.76,156.21 U32.2 | 49.4,153.67 U29.12 | 49.4,148.59 U29.5 | 49.4,148.59 U29.10 | 49.4,153.67 49.4,148.59 | v49.4,166.37 49.4,156.21 | 49.4,156.21 49.4,153.67 | 49.4,156.21 U29.13 | 135.76,156.21 v135.76,165.1 135.76,171.45 139.57,175.26 139.57,180.34 | 139.57,180.34 U41.5 | 139.57,180.34 142.11,180.34 | 142.11,180.34 U41.10 | U41.2 139.57,185.42 139.57,180.34 | U41.13 142.11,185.42 142.11,180.34
ESKP  (via drill 0.81)
  Top 0.406: U25.13 196.72,120.65 196.72,129.54 196.09,130.18 108.46,130.18 v107.82,130.81
  Bottom 0.406: U31.4 107.82,148.59 v107.82,130.81
ESME  (via drill 0.81)
  Top 0.406: 25.27,58.42 18.92,58.42 16.38,60.96 16.38,137.16 11.3,142.24 11.3,195.58 13.84,198.12 171.32,198.12 v172.59,199.39 | 25.27,58.42 25.27,45.72 U1.13 | 25.27,58.42 v48.13,58.42
  Bottom 0.406: U42.8 172.59,177.8 v172.59,199.39 | v48.13,58.42 48.13,71.12 U11.11
GND  (via drill 0.81)
  Top 0.61: 115.44,115.57 117.98,115.57
  Top 0.813: EDGE.AF2 244.98,7.94 v244.98,19.05 | C48.- v237.36,19.05 | EDGE.AN2 225.93,8.26 v225.93,19.05 | EDGE.AT2 213.23,8.26 v213.23,19.05 | EDGE.BC1 185.29,8.89 v185.29,19.05 194.18,22.86 C7.2 194.18,44.45 U7.1 BB6.GND1 | EDGE.BF2 175.13,8.89 C46.- | EDGE.BT1 143.38,8.89 v143.38,19.05 156.08,29.21 v166.24,29.21 C6.2 | EDGE.BN2 156.08,8.89 v156.08,19.05 | EDGE.CF1 111.63,8.89 v111.63,19.05 107.82,22.86 C47.- | EDGE.CC1 121.79,8.89 v121.79,19.05 | EDGE.CT1 79.88,8.89 v79.88,19.05 79.88,27.94 87.5,31.11 96.39,31.11 | v92.58,19.05 92.58,8.89 EDGE.CN1 | C1.2 U1.7 15.11,29.21 | EDGE.DT2 10.03,8.26 v10.03,17.78 | EDGE.DN1 22.73,8.26 v22.73,17.78 | EDGE.DF2 41.78,8.26 v41.78,17.78 | EDGE.DC2 51.94,8.26 v51.94,17.78 | C28.2 244.98,194.31 241.17,190.5 236.09,179.07 | 236.09,179.07 U45.7 | U5.1 131.95,45.72 129.41,39.37 | 129.41,39.37 C5.2 | 129.41,39.37 BB4.GND1 123.06,35.56 116.71,31.11 111.63,31.11 | BB3.GND2 101.47,80.01 U13.1 111.63,80.01 111.63,77.47 U13.10 | BB6.GND2 185.29,82.55 U16.1 U16.11 U16.10 | BB8.GND2 U18.1 | U6.7 BB5.GND1 | v15.11,17.78 15.11,29.21 | 15.11,29.21 8.76,34.29 v8.76,67.31 | v72.26,38.1 BB2.GND1 | BB1.GND1 40.51,44.45 U2.1 48.13,43.18 48.13,35.56 | U40.4 95.12,182.88 92.58,185.42 C21.2 U39.14 79.88,185.42 77.34,187.96 | BB1.GND4 U29.7 | U28.1 17.65,156.21 17.65,137.16 | 17.65,137.16 C3.2 | 17.65,137.16 17.65,132.08 24,125.73 24,121.92 | 24,93.98 24,121.92 | U12.8 68.45,64.77 BB2.GND2 | BB3.GND1 96.39,31.11 | 96.39,31.11 109.09,31.11 | 109.09,31.11 111.63,31.11 | U4.1 106.55,45.72 106.55,39.37 U4.5 111.63,35.56 111.63,31.11 | BB4.GND2 129.41,67.31 U14.7 | BB5.GND2 158.62,68.58 U15.7 | BB1.GND2 U11.7 48.13,69.85 48.13,77.47 U11.2
  Top 0.813: BB1.GND3 U20.7 | BB2.GND3 68.45,109.22 U21.7 | U41.7 129.41,175.26 BB4.GND5 | C25.2 213.23,194.31 BB7.GND5 | BB8.GND5 236.09,179.07 | BB5.GND3 U24.5 | BB3.GND3 104.01,119.38 U22.1 112.9,115.57 115.44,115.57 | BB8.GND3 v239.9,110.49 | BB4.GND3 128.14,104.14 U23.8 | BB6.GND3 180.21,106.68 U25.7 | C15.2 219.58,166.37 218.31,165.1 218.31,161.29 U35.15 | U34.1 C13.2 | BB3.GND4 U31.7 | BB4.GND4 U32.7 | U26.7 215.77,109.22 215.77,119.38 | 215.77,119.38 C26.2 | BB8.GND4 U36.8 | BB1.GND5 U38.8 | 24,121.92 C20.2 | U39.8 81.15,177.8 U39.11 | U2.11 50.67,36.83 50.67,35.56 | U2.6 48.13,34.29 48.13,35.56 | 48.13,35.56 U2.5 | 48.13,35.56 50.67,35.56 | 50.67,35.56 U2.10 | BB5.GND4 U33.8 | 109.09,31.11 U4.7 | U10.7 24,71.12 24,93.98 | 24,93.98 C10.2 | 117.98,115.57 119.25,114.3 119.25,110.49 117.98,109.22 U22.10 | 215.77,119.38 U26.2 | U39.1 76.07,190.5 77.34,189.23 77.34,187.96 | U39.4 73.53,182.88 72.26,184.15 72.26,186.69 73.53,187.96 U39.2 77.34,187.96
  Busbar 0.813: BB1.GND5 37.97,170.18 37.97,138.43 | 37.97,138.43 BB1.GND4 | 37.97,138.43 37.97,102.87 BB1.GND3 35.43,88.9 37.97,85.09 37.97,67.31 | 37.97,67.31 BB1.GND2 | BB1.GND1 37.97,34.29 37.97,67.31 | BB2.GND1 69.72,40.64 69.72,73.66 | 69.72,73.66 BB2.GND2 | 69.72,73.66 69.72,99.06 67.18,101.6 BB2.GND3 69.72,111.76 69.72,127 67.18,129.54 BB2.GND4 69.72,147.32 69.72,177.8 BB2.GND5 | BB3.GND1 98.93,38.1 98.93,71.12 | 98.93,71.12 BB3.GND2 | 98.93,106.68 98.93,71.12 | 98.93,106.68 BB3.GND3 | BB3.GND5 98.93,175.26 98.93,144.78 BB3.GND4 96.39,127 98.93,124.46 98.93,106.68 | BB4.GND1 130.68,39.37 130.68,72.39 | 130.68,72.39 BB4.GND2 | 130.68,72.39 130.68,100.33 128.14,104.14 BB4.GND3 130.68,110.49 130.68,143.51 | BB4.GND5 128.14,168.91 130.68,166.37 130.68,143.51 | 130.68,143.51 BB4.GND4 | BB5.GND1 159.89,39.37 159.89,67.31 157.35,69.85 BB5.GND2 159.89,74.93 159.89,107.95 | 159.89,107.95 BB5.GND3 | 159.89,143.51 BB5.GND4 | 159.89,107.95 159.89,143.51 | BB5.GND5 157.35,157.48 159.89,154.94 159.89,143.51 | BB6.GND1 181.48,41.91 181.48,74.93 | 181.48,74.93 BB6.GND2 | 181.48,74.93 181.48,107.95 BB6.GND3 182.75,114.3 182.75,119.38 181.48,120.65 181.48,146.05 | BB6.GND5 181.48,179.07 181.48,146.05 | 181.48,146.05 BB6.GND4 | 209.42,107.95 BB7.GND3 | 209.42,107.95 209.42,143.51 | 209.42,143.51 209.42,176.53 BB7.GND5 | 209.42,143.51 BB7.GND4 | BB7.GND1 209.42,39.37 209.42,72.39 | 209.42,72.39 BB7.GND2 | 209.42,72.39 209.42,107.95 | 234.82,146.05 BB8.GND4 | 234.82,146.05 234.82,179.07 BB8.GND5 | 234.82,110.49 BB8.GND3 | 234.82,110.49 234.82,146.05 | 234.82,110.49 234.82,77.47 BB8.GND2 232.28,50.8 234.82,48.26 234.82,41.91 BB8.GND1
  Busbar 0.813: v51.94,17.78 v41.78,17.78 v22.73,17.78 | v92.58,19.05 v111.63,19.05 114.17,16.51 119.25,16.51 v121.79,19.05 123.06,20.32 142.11,20.32 v143.38,19.05 | v185.29,19.05 186.56,17.78 199.26,17.78 201.8,20.32 211.96,20.32 v213.23,19.05
  Bottom 0.813: EDGE.AT2 213.23,8.26 v213.23,19.05 | EDGE.AN2 225.93,8.26 v225.93,19.05 | EDGE.AF2 244.98,8.26 v244.98,19.05 | EDGE.BC1 185.29,8.89 v185.29,19.05 175.13,19.05 | EDGE.BF2 175.13,8.89 175.13,19.05 | 175.13,19.05 C46.- | EDGE.BT1 143.38,8.89 v143.38,19.05 v156.08,19.05 | EDGE.BN2 156.08,8.89 v156.08,19.05 | EDGE.CF1 111.63,8.89 v111.63,19.05 | EDGE.CC1 121.79,8.89 v121.79,19.05 | EDGE.CT1 79.88,8.89 v79.88,19.05 | EDGE.CN1 92.58,8.89 v92.58,19.05 v79.88,19.05 | EDGE.DT2 10.03,8.26 v10.03,17.78 v15.11,17.78 v22.73,17.78 22.73,8.26 EDGE.DN1 | EDGE.DF2 41.78,8.26 v41.78,17.78 41.78,43.18 U2.1 | EDGE.DC2 51.94,8.26 v51.94,17.78 54.48,20.32 72.26,20.32 | v79.88,19.05 78.61,20.32 | 78.61,20.32 76.07,20.32 C2.2 | v213.23,19.05 U8.7 BB7.GND1 | U28.1 20.19,160.02 22.73,162.56 C17.2 22.73,182.88 U37.1 | C19.2 34.16,191.77 37.02,187.01 37.02,175.58 BB1.GND5 | U40.4 112.9,185.42 | 112.9,185.42 U40.14 | U40.1 112.9,189.23 112.9,187.96 | 112.9,187.96 U40.2 | 112.9,185.42 112.9,187.96 | BB3.GND5 98.93,172.72 104.01,172.72 | 104.01,172.72 U40.8 | 104.01,172.72 C22.2 | v8.76,67.31 U10.7 | 78.61,20.32 72.26,20.32 | 72.26,20.32 v72.26,38.1 72.26,43.18 U3.1 | v156.08,19.05 175.13,19.05 | v213.23,19.05 v225.93,19.05 | v225.93,19.05 C48.- | v225.93,19.05 225.93,26.67 232.28,29.21 232.28,31.75 | 232.28,31.75 BB8.GND1 U9.1 C9.2 | 232.28,31.75 C8.2 | EDGE.AC2 255.14,8.89 255.14,17.78 253.87,19.05 v244.98,19.05 | v237.36,19.05 v244.98,19.05 | U18.1 C18.2 | U27.8 C27.2 | U11.7 C11.2 | U38.8 C4.2 | BB2.GND4 U30.7 | BB2.GND5 67.18,179.07 U39.8 | U39.14 81.15,185.42 79.88,184.15 79.88,179.07 81.15,177.8 U39.11 | C12.2 102.74,148.59 BB3.GND4 | v166.24,29.21 U6.7
  Bottom 0.813: C14.2 138.62,83.82 138.62,68.58 U14.7 U5.1 | BB5.GND5 U42.7 | U24.7 164.97,107.95 164.97,110.49 | U24.5 164.97,110.49 | 164.97,120.65 C24.2 | 164.97,110.49 164.97,120.65 | 164.97,120.65 U24.1 | BB6.GND4 181.48,154.94 U34.1 | C23.2 BB6.GND5 U43.7 | BB7.GND3 U26.7 | BB7.GND2 U17.8 | BB7.GND4 U35.8 218.31,147.32 218.31,156.21 U35.15 | BB7.GND5 U44.7 | v239.9,110.49 239.9,105.41 U27.8 | U27.8 246.25,106.68 246.25,114.3 | U27.2 246.25,116.84 246.25,114.3 | 246.25,114.3 U27.4 | U36.8 C16.2
INITH  (via drill 0.81)
  Top 0.406: U34.10 209.42,144.78 209.42,140.97 206.88,138.43 117.98,138.43 115.44,140.97 | 115.44,140.97 v110.36,140.97 | 115.44,140.97 U31.8 | R4.2 31.62,113.03 31.62,121.92 32.89,123.19 79.88,123.19 81.15,121.92 v110.36,121.92
  Bottom 0.406: U22.6 110.36,107.95 110.36,111.76 | 110.36,111.76 U22.4 | 110.36,111.76 v110.36,121.92 v110.36,140.97
INITIALIZE  (via drill 0.81)
  Top 0.406: EDGE.CR1 86.23,8.26 86.23,25.4 91,28.89 103.7,28.89 v104.01,28.57 | v105.28,105.41 115.44,105.41 U22.9
  Bottom 0.406: v104.01,28.57 104.01,104.14 v105.28,105.41
IO_PAUSE
  Bottom 0.406: U13.14 112.9,86.36 112.9,143.51 U31.5
IOT36
  Top 0.406: U25.1 191.64,121.92 192.91,120.65 192.91,119.38 | 192.91,114.3 192.91,119.38 | 192.91,114.3 192.91,113.03 191.64,111.76 U25.5 | 192.91,119.38 U25.2 | 192.91,114.3 U25.4
  Bottom 0.406: U7.3 192.91,45.72 192.91,111.76 U25.4
IR1
  Top 0.406: U24.3 U24.12
IRQ  (via drill 0.81)
  Top 0.406: U26.6 209.42,113.03 201.8,113.03 U25.12 191.64,110.49 v181.48,110.49
  Bottom 0.406: U6.9 168.78,36.83 168.78,38.1 | 168.78,38.1 U6.10 | 168.78,38.1 168.78,55.88 181.48,68.58 v181.48,110.49
ISCDF
  Top 0.406: U39.6 70.99,180.34 70.99,190.5 73.53,193.04 88.77,193.04 90.04,191.77 92.58,191.77 93.85,193.04 174.18,193.04 175.45,194.31 190.37,194.31 194.18,190.5 199.26,190.5 199.26,187.96 U43.13
MD01H  (via drill 0.81)
  Top 0.406: v161.16,142.24 189.1,142.24 U34.7
  Bottom 0.406: U24.2 161.16,119.38 v161.16,142.24
MD09H  (via drill 0.81)
  Top 0.406: U33.13 173.86,156.21 173.86,168.91 172.91,169.54 56.39,169.54 v55.75,168.91
  Bottom 0.406: U2.2 49.4,45.72 49.4,54.61 57.02,59.69 57.02,163.83 55.75,165.1 v55.75,168.91
MD10H  (via drill 0.81)
  Top 0.406: v58.29,166.37 59.56,167.64 166.24,167.64 168.78,165.1 168.78,157.48 U33.14
  Bottom 0.406: U2.14 53.21,54.61 59.56,58.42 59.56,163.83 58.29,165.1 v58.29,166.37
MD11H  (via drill 0.81)
  Top 0.406: v57.02,167.64 57.97,168.59 171.32,168.59 172.59,167.64 172.59,161.29 U33.15
  Bottom 0.406: v57.02,167.64 57.02,165.1 58.29,163.83 58.29,59.37 50.67,54.29 50.67,44.45 U2.3
N$1
  Top 0.406: U21.6 76.07,106.68 77.34,105.41 77.34,104.14 76.07,102.87 72.26,102.87 70.99,104.14 55.75,104.14 54.48,102.87 50.67,102.87 U20.5
N$2
  Top 0.406: U9.3 246.25,45.72 246.25,59.69 244.98,60.96 213.23,60.96 211.96,62.23 211.96,74.93 U17.4
N$3  (via drill 0.81)
  Top 0.406: U14.11 139.57,81.28 139.57,85.41 138.62,86.36 133.86,86.36 133.22,86.04 132.59,86.36 v88.77,86.36 | v88.77,57.15 31.62,57.15 30.35,55.88 30.35,38.1 29.08,36.83 21.46,36.83 U1.5
  Bottom 0.406: v88.77,57.15 v88.77,86.36
N$4
  Top 0.406: U9.7 247.52,36.83 247.52,38.1 | 247.52,38.1 U9.5 | 256.41,54.61 256.41,48.26 U9.12 247.52,39.37 247.52,38.1 | 256.41,66.04 256.41,54.61 | 256.41,66.04 256.41,96.52 248.79,104.14 248.79,109.22 247.52,110.49 242.44,110.49 239.9,107.95 217.04,107.95 214.5,105.41 197.68,105.41 192.59,100.33 170.37,100.33 169.74,99.69 151.32,99.69 149.73,98.11 90.04,98.11 88.77,98.74 87.5,98.11 82.42,98.11 81.79,97.47 80.2,97.47 79.25,98.42 41.78,98.42 40.83,99.06 35.43,99.06 26.54,102.87 26.54,105.41 31.62,105.41 34.16,107.95 34.16,115.57 35.43,116.84 U20.2 | 256.41,54.61 R7.2 | 242.44,68.58 242.44,72.39 U18.5 | 242.44,68.58 U18.7 | 242.44,68.58 242.44,67.31 243.71,66.04 256.41,66.04 | 247.52,38.1 U9.10
N$5  (via drill 0.81)
  Top 0.406: U27.6 237.36,102.87 197.68,102.87 193.23,98.42 171,98.42 170.37,97.79 151.96,97.79 149.41,95.25 147.19,95.25 145.92,94.61 144.65,95.25 90.04,95.25 88.77,95.89 87.5,95.25 83.38,95.25 82.74,94.61 79.25,94.61 78.61,95.25 v50.67,95.25
  Bottom 0.406: U11.12 50.67,80.01 v50.67,95.25
N$10
  Top 0.406: U9.13 252.6,46.99 252.6,63.5 251.33,64.77 224.66,64.77 223.39,66.04 223.39,69.85 222.12,71.12 U17.11
N$11
  Top 0.406: U9.14 251.33,60.96 250.06,62.23 215.77,62.23 214.5,63.5 214.5,69.85 U17.6
N$12
  Top 0.406: U9.2 241.17,48.26 241.17,58.42 239.9,59.69 213.23,59.69 210.69,62.23 210.69,76.2 U17.3
N$14
  Top 0.406: U17.13 228.47,76.2 238.63,85.09 244.98,85.09 244.98,82.55 U18.2
N$18  (via drill 0.81)
  Top 0.406: v82.42,85.09 82.74,84.77 106.55,85.09 134.49,85.09 135.76,83.82 135.76,73.66 U15.5 164.97,76.2 164.97,78.74 U15.2 | U20.8 55.75,110.49 77.34,110.49 v78.61,109.22 | U8.2 211.96,44.45 211.96,39.37 U8.5 211.96,36.83 211.96,31.75 213.23,30.48 214.5,30.48 218.31,34.29 218.31,43.18 U8.13 222.12,44.45 222.12,39.37 U8.10 | v201.8,83.82 200.53,85.09 185.29,85.09 172.59,74.93 172.59,72.39 U15.9
  Bottom 0.406: v78.61,109.22 79.88,107.95 79.88,102.87 82.42,100.33 v82.42,85.09 | U8.2 201.8,53.34 v201.8,83.82 | U15.9 168.78,71.12 167.51,72.39 167.51,73.66 | 167.51,73.66 U15.5 | 167.51,73.66 U15.10
N$20  (via drill 0.81)
  Top 0.406: U18.10 253.87,76.2 253.87,78.74 | 253.87,78.74 U18.12 | 253.87,78.74 253.87,96.52 252.6,97.79 194.18,97.79 193.87,97.47 171.32,97.47 170.69,96.84 152.27,96.84 149.73,94.3 147.19,94.3 145.92,93.66 144.65,94.3 89.09,94.3 v88.77,94.61 88.45,94.3 83.69,94.3 83.06,93.66 78.93,93.66 78.3,94.3 44.32,93.98 v43.05,95.25
  Bottom 0.406: v43.05,95.25 43.05,110.49 U20.4 | 78.61,36.83 U3.5 | 78.61,36.83 U3.10 | U3.7 78.61,34.29 78.61,36.83 | 78.61,36.83 78.61,39.37 U3.12 84.96,41.91 87.5,44.45 87.5,93.03 v88.77,94.61
  Bottom 0.813: U18.12 R8.1
N$21  (via drill 0.81)
  Top 0.406: U42.3 158.62,182.88 158.62,173.99 159.89,172.72 187.83,172.72 188.78,171.77 191.96,171.77 192.91,172.72 v194.18,172.72
  Bottom 0.406: v194.18,172.72 194.18,162.56 195.45,161.29 195.45,146.05 196.72,144.78 199.26,144.78 199.26,97.79 197.99,96.52 U16.14
N$22  (via drill 0.81)
  Top 0.406: U18.13 252.6,82.55 252.6,93.98 251.33,95.25 203.07,95.25 201.8,93.98 191.01,93.98 190.37,94.61 172.28,94.61 171.64,93.98 153.22,93.98 150.69,91.44 147.19,91.44 145.92,90.81 144.65,91.44 84.65,91.44 84.01,90.81 79.25,90.81 v78.61,90.17
  Bottom 0.406: U12.4 78.61,77.47 v78.61,90.17
N$23  (via drill 0.81)
  Top 0.406: U18.14 251.33,92.71 250.06,93.98 203.07,93.98 202.12,93.03 190.06,93.03 189.42,93.66 172.59,93.66 171.96,93.03 153.54,93.03 151,90.49 147.19,90.49 145.92,89.85 144.65,90.49 85.28,90.49 84.65,89.85 80.84,89.85 79.88,88.9 v77.34,88.9
  Bottom 0.406: U12.3 77.34,78.74 v77.34,88.9
N$24
  Top 0.406: U17.14 229.74,78.74 238.63,86.36 244.98,86.36 246.25,85.09 246.25,81.28 U18.3
N$25
  Bottom 0.406: U27.10 256.41,111.76 256.41,149.86 U36.14 246.25,152.4 246.25,149.86 U36.7
N$30
  Top 0.406: U27.1 253.87,129.54 253.87,175.26 U45.9
N$31
  Bottom 0.406: U27.14 252.6,118.11 252.6,143.51 U36.10
N$32
  Bottom 0.406: U27.11 255.14,113.03 255.14,146.05 U36.12
N$33
  Bottom 0.406: U27.9 257.68,110.49 257.68,151.13 U36.15
N$34
  Top 0.406: U27.15 250.06,120.65 250.06,124.46 255.14,128.27 255.14,181.61 U45.12
  Bottom 0.406: U45.12 247.52,187.96 247.52,190.5 246.25,191.77 242.44,191.77 241.17,190.5 241.17,182.88 U45.5
N$35
  Top 0.406: U36.11 246.25,152.4 246.25,154.94 U36.2
  Bottom 0.406: U27.13 253.87,116.84 253.87,144.78 U36.11
N$36
  Bottom 0.406: U27.12 248.79,114.3 248.79,144.78 | U36.5 241.17,149.86 241.17,144.78 248.79,144.78 | 248.79,144.78 248.79,152.4 U36.13
N$40
  Top 0.406: U36.9 252.6,146.05 252.6,168.91 248.79,172.72 | 248.79,172.72 196.72,172.72 192.91,176.53 U43.6 | U45.11 248.79,180.34 248.79,172.72
  Bottom 0.406: U45.11 U45.3
N$49
  Top 0.406: R10.2 C29.2 247.52,204.47 248.79,203.2 248.79,190.5 U45.13
N$57  (via drill 0.81)
  Top 0.406: U43.8 246.25,173.99 247.52,175.26 v247.52,180.34 247.52,186.69 U45.1
  Bottom 0.406: v247.52,180.34 U45.10
N$63
  Top 0.406: R10.1 7.49,204.47 4.95,201.93 4.95,139.7 10.03,134.62 10.03,36.83 13.84,34.29 25.27,34.29 U1.10
  Bottom 0.406: U1.10 26.54,35.56 25.27,36.83 26.54,38.1 U1.11
N$82  (via drill 0.81)
  Top 0.406: v117.98,131.44 118.3,131.13 196.41,131.13 196.72,130.81 217.04,130.81 218.31,129.54 218.31,116.84 U26.11
  Bottom 0.406: U4.14 117.98,49.53 v117.98,131.44
N$91  (via drill 0.81)
  Top 0.406: U31.10 117.98,146.05 117.98,139.7 200.53,139.7 v201.8,140.97
  Bottom 0.406: v201.8,140.97 201.8,116.84 204.34,114.3 U26.4
N$94  (via drill 0.81)
  Top 0.406: U26.12 219.58,118.11 219.58,129.54 217.04,132.08 119.25,132.08 117.98,132.72 116.71,132.08 101.47,132.08 100.2,130.81 97.66,130.81 96.39,132.08 76.39,132.08 v76.07,131.76
  Bottom 0.406: U30.6 76.07,146.05 v76.07,131.76
N$97
  Bottom 0.406: U26.10 223.39,114.3 223.39,121.92 222.12,123.19 204.34,123.19 203.07,124.46 203.07,153.67 U34.14
N$104
  Bottom 0.406: U35.4 214.5,154.94 214.5,157.48 215.77,158.75 215.77,180.34 U44.4
N$109
  Top 0.406: U38.6 40.51,179.07 32.89,179.07 30.35,181.61 26.54,181.61 21.46,181.61 U37.3
N$115
  Bottom 0.406: U44.13 222.12,186.69 222.12,144.78 U35.9
N$116
  Bottom 0.406: U35.7 217.04,149.86 217.04,157.48 218.31,158.75 218.31,175.26 U44.9
N$117
  Top 0.406: U44.1 214.5,190.5 215.77,189.23 215.77,187.96 | 215.77,187.96 U44.2 | U1.3 12.57,43.18 12.57,134.62 7.49,139.7 7.49,199.39 10.03,201.93 180.21,201.93 181.48,200.66 218.31,200.66 219.58,199.39 219.58,187.96 | 219.58,187.96 215.77,187.96 | 219.58,180.34 U44.5 | 219.58,180.34 U44.10 | 219.58,187.96 219.58,185.42 | 219.58,185.42 219.58,180.34 | 219.58,185.42 U44.12
N$131  (via drill 0.81)
  Top 0.406: U13.2 106.55,80.01 102.74,78.74 102.74,60.96 104.33,59.05 v187.83,59.05
  Bottom 0.406: U7.4 187.83,43.18 v187.83,59.05
N$133  (via drill 0.81)
  Top 0.406: v197.99,62.23 144.02,62.23 143.38,62.55 142.75,62.23 116.71,62.23 112.9,68.58 110.36,72.39 U13.5 | R1.2 27.81,125.73 29.08,127 62.1,127 63.37,125.73 81.15,125.73 83.69,123.19 v111.63,123.19
  Bottom 0.406: v197.99,62.23 197.99,50.8 196.72,49.53 196.72,44.45 U7.12 | U13.7 111.63,69.85 111.63,72.39 | 111.63,72.39 U13.5 | 111.63,72.39 v111.63,123.19 111.63,142.24 U31.6
N$136  (via drill 0.81)
  Top 0.406: U13.3 107.82,76.2 107.82,62.23 110.05,60.01 187.2,60.01 187.83,60.33 188.47,60.01 196.41,60.01 v196.72,59.69
  Bottom 0.406: U7.11 195.45,43.18 195.45,49.53 196.72,50.8 v196.72,59.69
N$139  (via drill 0.81)
  Top 0.406: v168.78,90.17 153.54,90.17 151.64,88.58 147.19,88.58 145.92,87.95 145.29,88.27 140.21,88.27 139.57,87.95 138.94,88.27 137.99,89.53 86.87,89.53 86.23,88.9 81.15,88.9 79.88,87.63 76.07,87.63 74.8,88.9 50.67,88.9 v49.4,90.17 27.81,90.17 26.54,88.9 26.54,81.28 U10.13 | v168.78,102.87 169.1,103.19 190.69,103.19 192.91,105.41 192.91,106.68 U25.10 | U15.12 166.24,74.93 v166.24,69.85 | U10.5 22.73,74.93 22.73,77.47 U10.2
  Bottom 0.406: U20.10 49.4,106.68 v49.4,90.17 | v168.78,102.87 v168.78,90.17 168.78,81.28 | 168.78,81.28 U15.13 | U15.12 168.78,80.01 168.78,81.28 | v166.24,69.85 166.24,45.72 | 166.24,45.72 166.24,41.91 U6.5 | 166.24,45.72 U6.2 | U10.13 U10.2
N$160  (via drill 0.81)
  Top 0.406: v181.48,116.84 U25.3 | U33.12 167.51,153.67 167.51,165.1 166.24,166.37 135.76,166.37 135.44,166.69 61.47,166.69 v60.83,166.37 | R2.2 29.08,115.57 29.08,124.46 30.35,125.73 v60.83,125.73
  Bottom 0.406: U33.12 172.59,149.86 172.59,146.05 173.86,144.78 180.21,144.78 181.48,143.51 v181.48,116.84 | v60.83,166.37 v60.83,125.73
N$161  (via drill 0.81)
  Top 0.406: U34.11 210.69,146.05 210.69,140.97 206.88,137.16 116.71,137.16 114.17,139.7 87.5,139.7 U30.8 | R3.2 30.35,114.3 30.35,123.19 31.62,124.46 v79.88,124.46
  Bottom 0.406: U30.8 79.88,142.24 v79.88,124.46 79.88,116.84 U21.12
N$167  (via drill 0.81)
  Top 0.406: U34.9 196.72,146.05 191.64,140.97 v119.25,140.97
  Bottom 0.406: U4.13 119.25,48.26 v119.25,140.97
N$172  (via drill 0.81)
  Top 0.406: v74.8,130.81 75.12,130.49 77.98,130.49 78.3,130.81 94.81,130.81 100.2,128.27 143.38,128.27 144.65,127.64 145.92,128.27 190.37,128.27 v191.64,127
  Bottom 0.406: U34.2 191.64,154.94 v191.64,127 | v74.8,130.81 U21.1
N$177  (via drill 0.81)
  Top 0.406: U1.4 11.3,41.91 11.3,134.62 6.22,139.7 6.22,200.66 8.76,203.2 180.21,203.2 181.48,201.93 v195.45,201.93 | U43.11 U43.4
  Bottom 0.406: U43.11 195.45,184.15 v195.45,201.93
N$178
  Bottom 0.406: U43.5 189.1,179.07 187.83,180.34 187.83,182.88 189.1,184.15 U43.3
N$212  (via drill 0.81)
  Top 0.406: U23.9 143.38,102.87 107.82,102.87 106.55,104.14 86.87,104.14 85.6,102.87 81.15,102.87 79.88,104.14 79.88,120.65 78.61,121.92 v54.48,121.92
  Bottom 0.406: U14.8 143.38,68.58 143.38,83.82 144.65,83.82 144.65,86.36 143.38,87.63 143.38,102.87 U23.9 | U38.9 54.48,170.18 v54.48,121.92
N$218  (via drill 0.81)
  Top 0.406: v63.37,130.81 67.18,128.59 95.12,128.59 97.66,126.36 143.38,126.36 144.65,125.73 166.24,125.73 167.51,124.46 167.51,120.65 U24.13
  Bottom 0.406: U30.3 U30.4 63.37,144.78 v63.37,130.81
N$248
  Bottom 0.406: U5.3 134.49,45.72 134.49,114.3 U23.3
N$250  (via drill 0.81)
  Top 0.406: U5.6 139.57,36.83 139.57,38.1 | 139.57,38.1 U5.5 | 142.11,38.1 U5.10 | 142.11,38.1 139.57,38.1 | 142.11,38.1 142.11,39.37 143.38,40.64 U5.11 | v48.13,88.9 49.4,87.63 74.8,87.63 76.07,86.36 79.88,86.36 81.15,87.63 86.23,87.63 87.19,88.58 132.91,88.58 v133.22,88.27 | v48.13,132.08 26.54,132.08 25.27,133.35 25.27,146.05 U28.10 | U37.11 25.27,176.53 25.27,175.26 | U37.10 25.27,175.26 | U37.6 22.73,173.99 22.73,175.26 | 22.73,175.26 U37.5 | 25.27,175.26 22.73,175.26 | v148.46,64.77 190.37,64.77 192.91,67.31 192.91,76.2 U16.3
  Bottom 0.406: U5.5 133.22,41.91 v133.22,88.27 | U11.4 48.13,77.47 v48.13,88.9 v48.13,132.08 | U28.11 26.54,151.13 25.27,149.86 25.27,148.59 | 22.73,148.59 U28.5 | 25.27,148.59 22.73,148.59 | U28.10 25.27,148.59 | U28.6 21.46,146.05 22.73,147.32 22.73,148.59 | 22.73,148.59 22.73,160.02 24,161.29 24,171.45 U37.10 | U5.11 148.46,44.45 v148.46,64.77
N$256
  Bottom 0.406: U5.13 145.92,46.99 145.92,63.5 142.11,67.31 142.11,106.68 U23.11
N$257
  Bottom 0.406: U5.14 144.65,63.5 140.84,67.31 140.84,105.41 U23.6
N$258
  Bottom 0.406: U5.2 135.76,46.99 135.76,113.03 U23.4
N$274
  Top 0.406: U23.14 143.38,118.11 143.38,124.46 142.43,125.41 97.34,125.41 94.81,127.64 64.01,127.64 60.83,130.81 25.27,130.81 24,132.08 24,152.4 U28.2
N$275
  Top 0.406: U23.13 142.11,116.84 142.11,124.46 83.69,124.46 81.47,126.68 63.69,126.68 62.1,128.27 25.27,128.27 22.73,130.81 22.73,151.13 U28.3
N$330  (via drill 0.81)
  Top 0.406: U13.13 115.44,80.01 111.63,83.82 v79.88,83.82
  Bottom 0.406: U21.5 78.61,106.68 78.61,101.6 79.88,100.33 v79.88,83.82
N$333
  Top 0.406: U22.2 107.82,116.84 106.55,115.57 106.55,114.3 107.82,113.03 115.44,113.03 U22.11
N$334
  Top 0.406: U22.3 U22.12
N$336
  Top 0.406: U22.5 101.47,105.41 83.69,105.41 U21.8
N$342
  Bottom 0.406: U22.13 114.17,119.38 114.17,147.32 U31.11
N$350
  Top 0.406: U31.13 112.9,151.13 106.55,151.13 104.01,148.59 87.5,148.59 U30.12
N$356  (via drill 0.81)
  Top 0.406: v55.75,151.13 77.34,151.13 79.88,148.59 84.96,148.59 87.5,146.05 110.36,146.05 U31.12 | U20.9 50.67,107.95 50.67,110.49 U20.11
  Bottom 0.406: U20.11 55.75,115.57 v55.75,151.13
N$358
  Top 0.406: U40.6 107.82,180.34 95.12,180.34 91.31,184.15 76.07,184.15 U39.3
N$372
  Bottom 0.406: U3.3 78.61,43.18 84.96,43.18 84.96,68.58 U12.11
N$380
  Bottom 0.406: U3.13 78.61,48.26 78.61,71.12 78.61,72.39 U12.14
N$381
  Bottom 0.406: U3.14 79.88,49.53 79.88,71.12 U12.13
N$382
  Bottom 0.406: U3.2 77.34,45.72 77.34,50.8 74.8,53.34 74.8,68.58 U12.6
N$401
  Top 0.406: U21.4 54.48,111.76 U20.12 46.86,114.3 | U20.1 46.86,116.84 46.86,114.3 | U20.3 46.86,114.3
N$406
  Bottom 0.406: U21.11 78.61,115.57 78.61,149.86 U30.11
N$408